# Altium project FLEXI_HAL_2000.PrjPCB (part 1 of 3)
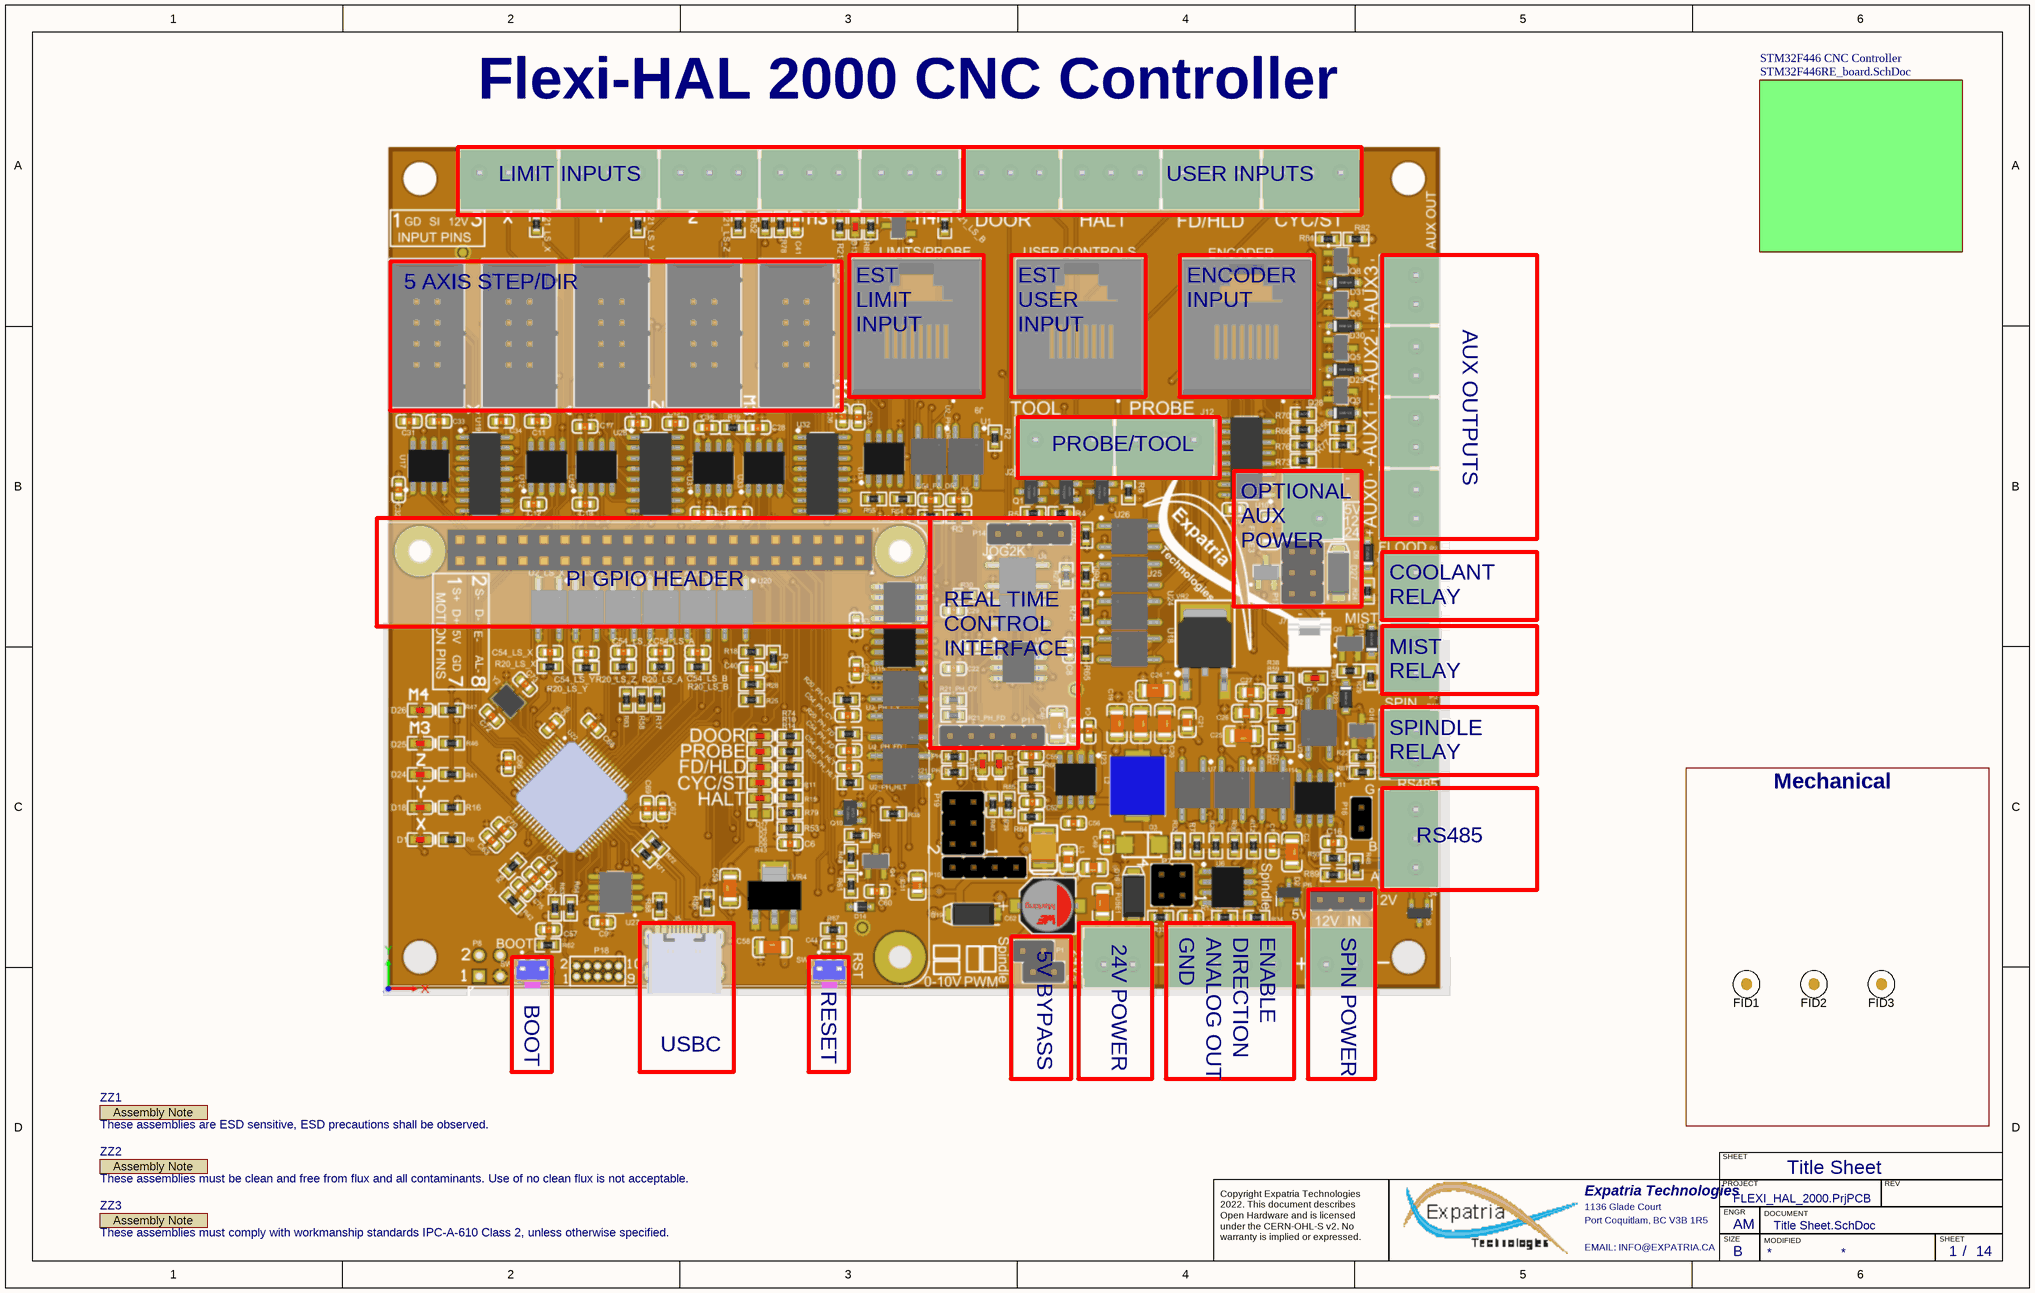
[diagram p0: Title Sheet.SchDoc]
PCBPARTNO: Flexi-HAL 2000; PCBREVNO: A7; Title: Flexi-HAL 2000; VarRevNo: A7
15 sheets, 343 parts. Net scope: hierarchical (ports join the sheet entries above them; power ports are global).
Board file: STMF446_CNC_board.pcbdoc
Sheets:
  Title Sheet.SchDoc
    STM32F446 CNC Controller = STM32F446RE_board.SchDoc
      LIM_SW = Limit_Switches.SchDoc
        LS_X = Photocoupler12Vinput.SchDoc
        LS_Y = Photocoupler12Vinput.SchDoc
        LS_Z = Photocoupler12Vinput.SchDoc
        LS_A = Photocoupler12Vinput.SchDoc
        LS_B = Photocoupler12Vinput.SchDoc
      USR_SW = Misc_switches.SchDoc
        PH_CY = Photocoupler12Vinput.SchDoc
        PH_FD = Photocoupler12Vinput.SchDoc
        PH_DR = Photocoupler12Vinput.SchDoc
        PH_PR = 2xparallelswitch.SchDoc
        PH_HLT = 2xparallelswitch_HALT.SchDoc
      ST = Stepper_driver_group.SchDoc
      SPINDLE = Spindle_Control.SchDoc
      EXT_KEYPAD = I2C_Keypad.SchDoc
      MODBUS = RS485.SchDoc
      Microcontroller = MCU_STM32F446RE.SchDoc
      Encoder Input = Spindle_Sync.SchDoc
      5V_Supply = 5V_Power_Supply.SchDoc
      AUX_OUTPUTS = Aux_Outputs.SchDoc

## Sheet Title Sheet.SchDoc: STM32F446 CNC
size B; Author: AM; CompanyName: Expatria Technologies; DrawnBy: A.Marles; Engineer: AM; Organization: Expatria Technolgoies; DocumentNumber: 1; Revision: A7; SheetNumber: 1; SheetTotal: 14

### Parts
FID1  Fiducial  [Fiducial10-20]  (value not drawn)  (no BOM)
FID2  Fiducial  [Fiducial10-20]  (value not drawn)  (no BOM)
FID3  Fiducial  [Fiducial10-20]  (value not drawn)  (no BOM)
ZZ1  These assemblies are ESD sensitive, ESD precautions shall be observed.  [AssemblyNote]  (graphical)
ZZ2  These assemblies must be clean and free from flux and all contaminants. Use of no clean flux is not acceptable.  [AssemblyNote]  (graphical)
ZZ3  These assemblies must comply with workmanship standards IPC-A-610 Class 2, unless otherwise specified.  [AssemblyNote]  (graphical)

### Blocks framed on the sheet
Mechanical: FID1-FID3

### Sub-sheets
STM32F446 CNC Controller = STM32F446RE_board.SchDoc: no entries

### Notes on the sheet
- Flexi-HAL 2000 CNC Controller
- LIMIT INPUTS
- USER INPUTS
- 5 AXIS STEP/DIR
- EST
  LIMIT
  INPUT
- EST
  USER
  INPUT
- ENCODER
  INPUT
- AUX OUTPUTS
- PROBE/TOOL
- OPTIONAL
  AUX
  POWER
- PI GPIO HEADER
- COOLANT
  RELAY
- MIST
  RELAY
- SPINDLE
  RELAY
- REAL TIME CONTROL INTERFACE
- RS485
- 5V BYPASS
- 24V POWER
- GND
- ANALOG OUT
- DIRECTION
- ENABLE
- SPIN POWER
- BOOT
- RESET
- USBC
- Title Sheet
- SHEET
- Expatria Technologies
- 1136 Glade Court
- Port Coquitlam, BC V3B 1R5
- PROJECT
- SIZE
- ENGR
- MODIFIED
- DOCUMENT
- REV
- Copyright Expatria Technologies 2022. This document describes Open Hardware and is licensed under the CERN-OHL-S v2. No warranty is implied or expressed.
- EMAIL: INFO@EXPATRIA.CA
- B
- /
- (in symbol AssemblyNote) Assembly Note

### Library data of the parts
FID1-FID3 = Fiducial: FIDUCIAL NO ASSEMBLY; Manufacturer 1: NONE; Manufacturer Part Number 1: NONE; Value: Fiducial
ZZ1-ZZ3 = AssemblyNote: SymbolCreator: codlsc; SymbolVersion: 2010-05-18; CompType: AssemblyNote; ClassName: AssemblyNote; Publisher: Texas Instruments; LatestRevisionDate: 2012-06-14; LatestRevisionNote: Initial Version; Alternate Manufacturer: -; Alternate PartNumber: -; Parameter 1: *

## Sheet STM32F446RE_board.SchDoc: RP2040 CNC
size C; Author: AM; CompanyName: Expatria Technologies; DrawnBy: A.Marles; Engineer: AM; Organization: Expatria Technolgoies; Address1: Schematic; DocumentNumber: 2; Revision: A7; SheetNumber: 2; SheetTotal: 14
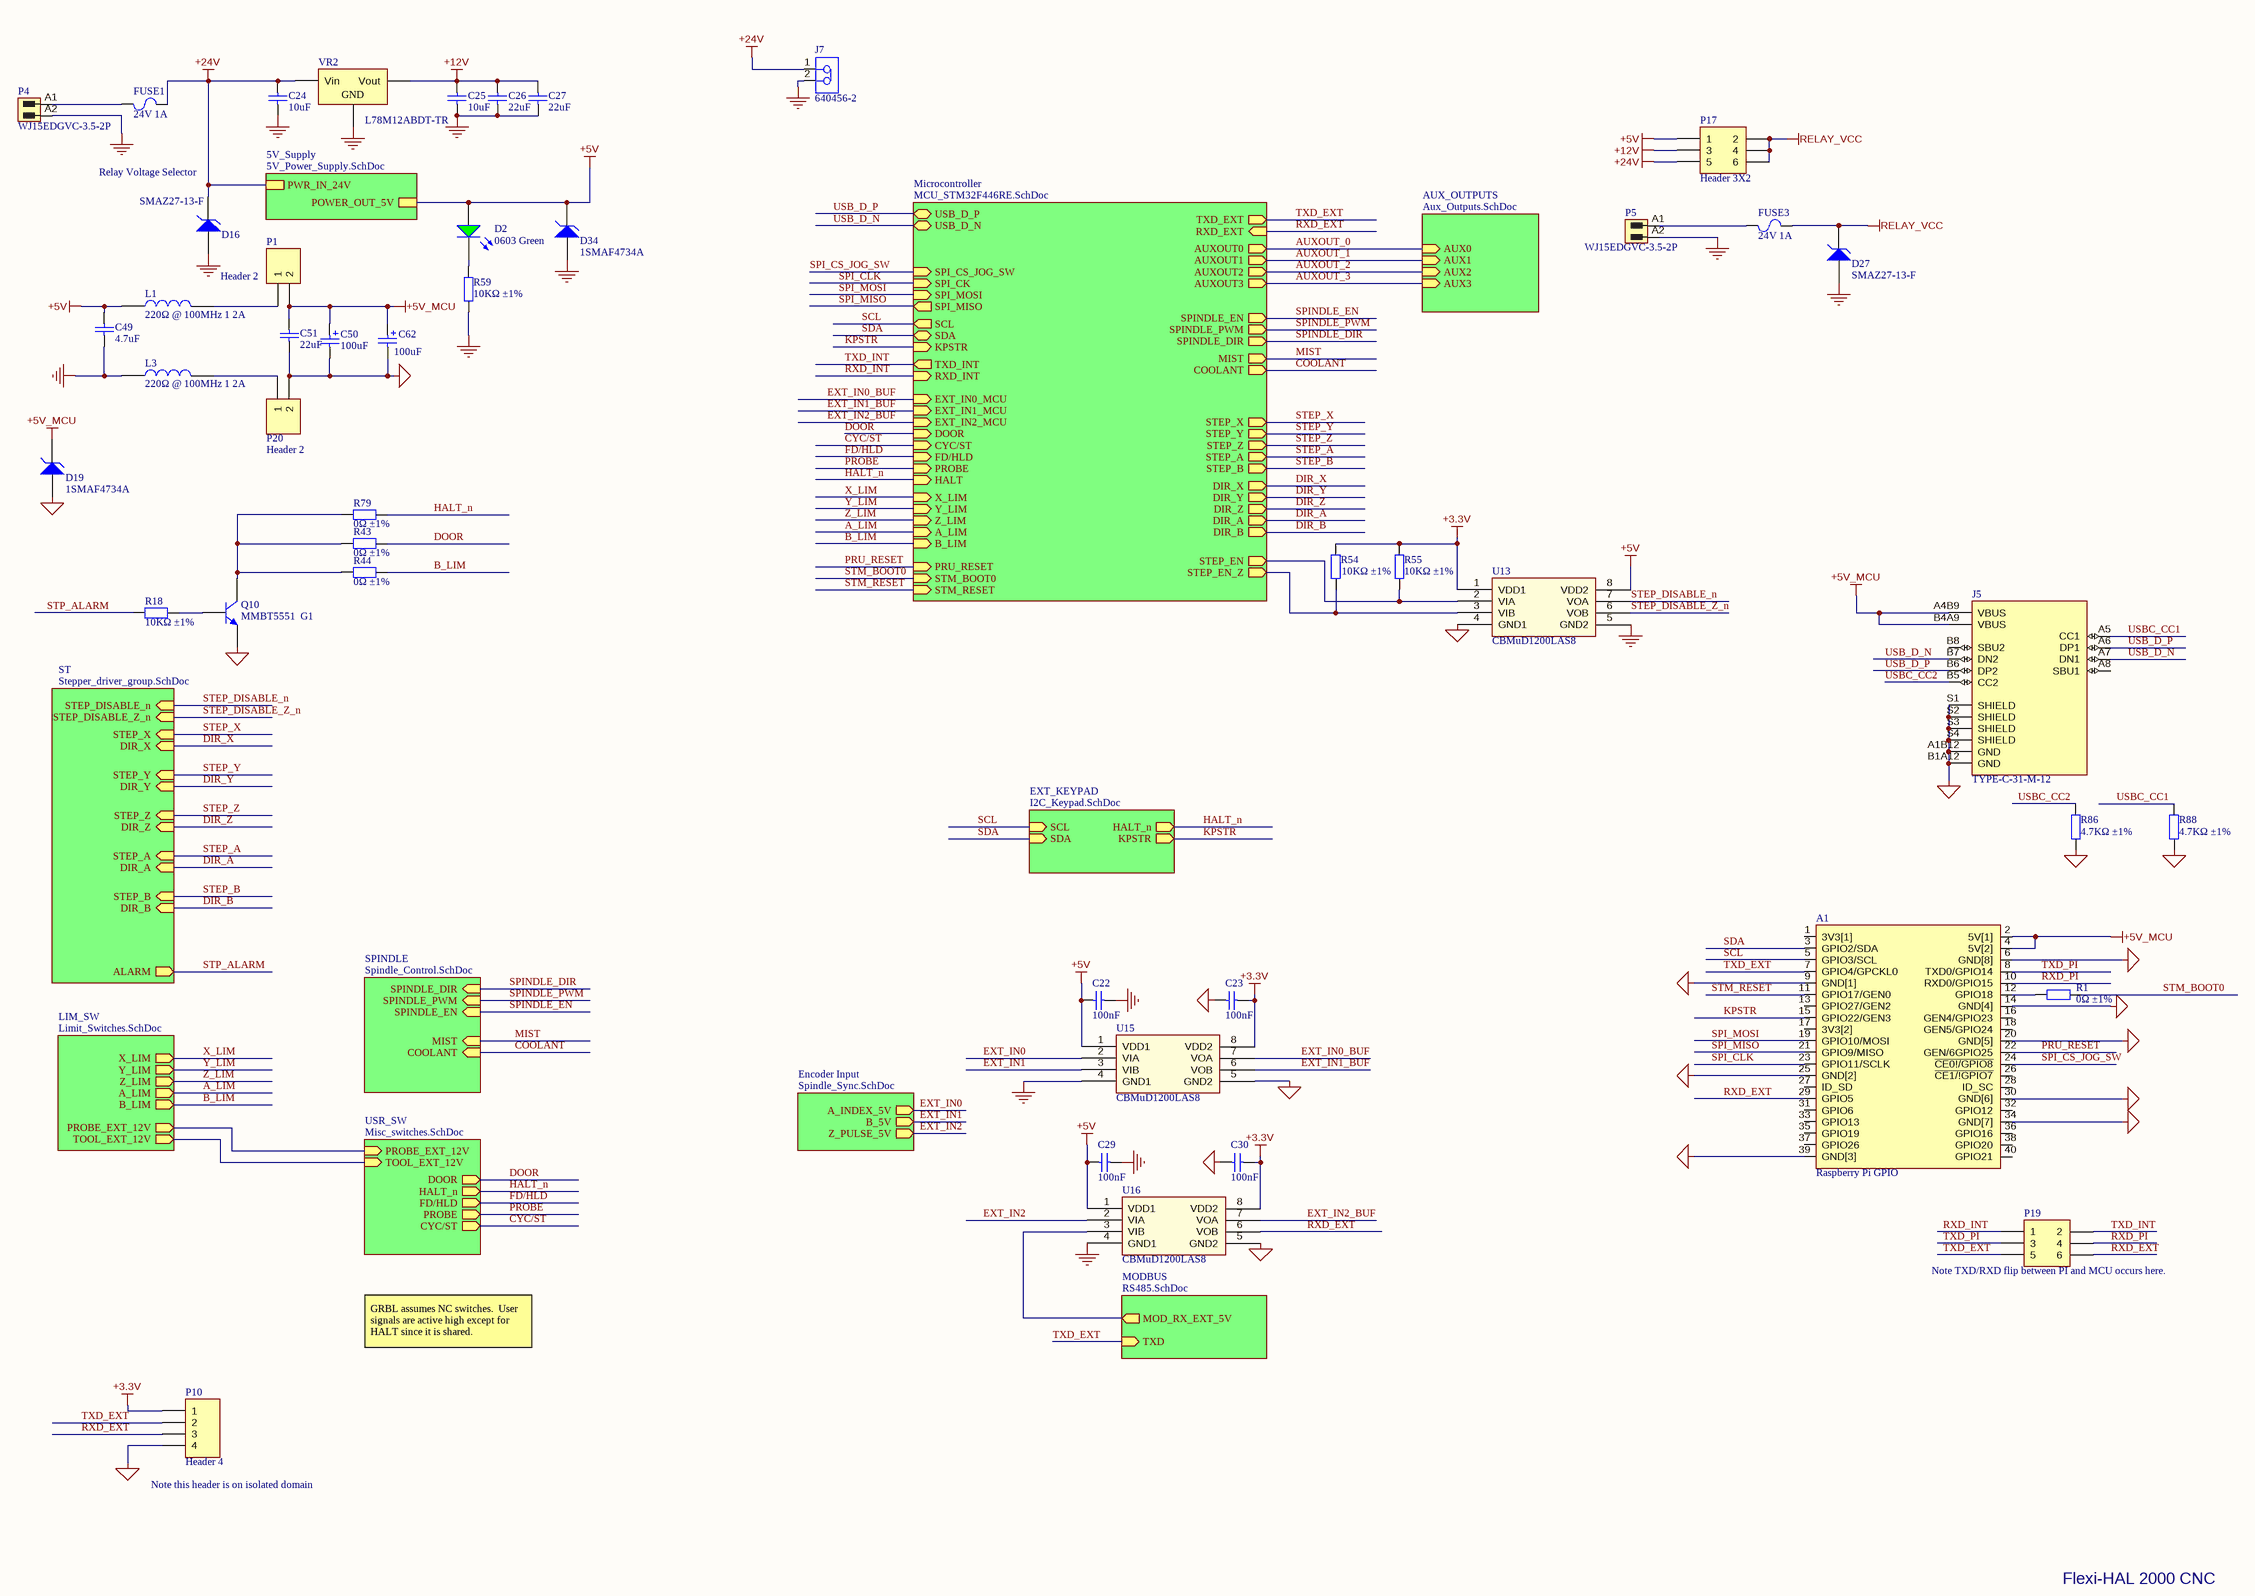
[diagram p1: STM32F446RE_board.SchDoc]

### Parts
A1  Raspberry Pi GPIO  [MODULE_RASPBERRY_PI_4_MODEL_B]
C22  100nF  [0603_C]
C23  100nF  [0603_C]
C24  10uF  [1206_C]
C25  10uF  [1206_C]
C26  22uF  [0805_C]
C27  22uF  [0805_C]
C29  100nF  [0603_C]
C30  100nF  [0603_C]
C49  4.7uF  [0603_C]
C50  100uF  [CASE-B_3528]
C51  22uF  [0805_C]
C62  100uF  [WCAP-ASLI_D6.3H7.7]
D2  0603 Green  [0603_LED_S1]
D16  SMAZ27-13-F  [DIOM5226X240N]
D19  1SMAF4734A  [DIOM5226X240N]
D27  SMAZ27-13-F  [DIOM5226X240N]
D34  1SMAF4734A  [DIOM5226X240N]
FUSE1  24V 1A  [1206_C]
FUSE3  24V 1A  [1206_C]
J5  TYPE-C-31-M-12  [HRO_TYPE-C-31-M-12]
J7  640456-2  [TECO-640456-2_V]
L1  220Ω @ 100MHz 1 2A  [0805_C]
L3  220Ω @ 100MHz 1 2A  [0805_C]
P1  Header 2  [HDR1X2]
P4  WJ15EDGVC-3.5-2P  [691321100002]
P5  WJ15EDGVC-3.5-2P  [691321100002]
P10  Header 4  [HDR1X4]
P17  Header 3X2  [HDR2X3]
P19  Header 3X2  [HDR2X3]  (value not drawn)
P20  Header 2  [HDR1X2]
Q10  MMBT5551  G1  [SOT-23(SOT-23-3)]
R1  0Ω ±1%  [0603_R]
R18  10KΩ ±1%  [0603_R]
R43  0Ω ±1%  [0603_R]
R44  0Ω ±1%  [0603_R]
R54  10KΩ ±1%  [0603_R]
R55  10KΩ ±1%  [0603_R]
R59  10KΩ ±1%  [0603_R]
R79  0Ω ±1%  [0603_R]
R86  4.7KΩ ±1%  [0603_R]
R88  4.7KΩ ±1%  [0603_R]
U13  CBMuD1200LAS8  [SOIC-8_150mil]
U15  CBMuD1200LAS8  [SOIC-8_150mil]
U16  CBMuD1200LAS8  [SOIC-8_150mil]
VR2  L78M12ABDT-TR  [TO-252-2-180]

### Sub-sheets
5V_Supply = 5V_Power_Supply.SchDoc: POWER_OUT_5V, PWR_IN_24V
AUX_OUTPUTS = Aux_Outputs.SchDoc: AUX3 (in), AUX0 (in), AUX1 (in), AUX2 (in)
Encoder Input = Spindle_Sync.SchDoc: A_INDEX_5V (out), Z_PULSE_5V (out), B_5V (out)
EXT_KEYPAD = I2C_Keypad.SchDoc: HALT_n (out), SCL (in), KPSTR (out), SDA (in)
LIM_SW = Limit_Switches.SchDoc: Y_LIM (out), Z_LIM (out), X_LIM (out), A_LIM (out), B_LIM (out), PROBE_EXT_12V (out), TOOL_EXT_12V (out)
Microcontroller = MCU_STM32F446RE.SchDoc: USB_D_P (bidir), EXT_IN2_MCU (in), DIR_B (out), EXT_IN1_MCU (in), RXD_INT (in), DIR_Y (out), EXT_IN0_MCU (in), USB_D_N (bidir), DIR_X (out), STEP_B (out), TXD_INT (out), STEP_A (out), SPI_CK (in), SPINDLE_PWM (out), STEP_Z (out), STEP_Y (out), SPI_MISO (out), SPI_MOSI (in), FD/HLD (in), STEP_X (out), CYC/ST (in), SPI_CS_JOG_SW (in), PROBE (in), AUXOUT3 (out), MIST (out), TXD_EXT (out), SDA (bidir), AUXOUT2 (out), AUXOUT0 (out), A_LIM (in), SCL (out), DIR_Z (out), KPSTR (in), RXD_EXT (in), COOLANT (out), SPINDLE_DIR (out), SPINDLE_EN (out), HALT (in), AUXOUT1 (out), DIR_A (out), PRU_RESET (in), X_LIM (in), Z_LIM (in), STM_BOOT0 (in), Y_LIM (in), STEP_EN (out), B_LIM (in), DOOR (in), STM_RESET (in), STEP_EN_Z (out)
MODBUS = RS485.SchDoc: TXD (in), MOD_RX_EXT_5V (out)
SPINDLE = Spindle_Control.SchDoc: SPINDLE_EN (in), SPINDLE_DIR (in), SPINDLE_PWM (in), COOLANT (in), MIST (in)
ST = Stepper_driver_group.SchDoc: STEP_Z (in), DIR_Z (in), STEP_X (in), STEP_B (in), DIR_X (in), DIR_A (in), DIR_Y (in), STEP_Y (in), DIR_B (in), STEP_A (in), ALARM (out), STEP_DISABLE_n (in), STEP_DISABLE_Z_n (in)
USR_SW = Misc_switches.SchDoc: FD/HLD (out), PROBE (out), CYC/ST (out), HALT_n (out), DOOR (out), PROBE_EXT_12V (in), TOOL_EXT_12V (in)

### Nets
+3.3V: C23.2 C30.2 P10.1 R54.1 R55.1 U13.1(VDD1) U15.8(VDD2) U16.8(VDD2)
+5V: C22.1 C29.1 C49.2 D2.A D34.2(K) L1.1 P17.1 U13.8(VDD2) U15.1(VDD1) U16.1(VDD1) ; sheet 5V_Supply/POWER_OUT_5V
+5V_MCU: A1.2(5V[1]) A1.4(5V[2]) C50.1 C51.2 C62.1(P) D19.2(K) J5.A4B9(VBUS) J5.B4A9(VBUS) P1.2
+12V: C25.2 C26.2 C27.2 P17.3 VR2.3(Vout)
+24V: C24.2 D16.2(K) FUSE1.2 J7.1 P17.5 VR2.1(Vin) ; sheet 5V_Supply/PWR_IN_24V
GND: C22.2 C24.1 C25.1 C26.1 C27.1 C29.2 C49.1 D16.1(A) D27.1(A) D34.1(A) J7.2 L3.1 P4.A2 P5.A2 R59.1 U13.5(GND2) U15.4(GND1) U16.4(GND1) VR2.2(GND)
MCU_GND: A1.6(GND[8]) A1.9(GND[1]) A1.14(GND[4]) A1.20(GND[5]) A1.25(GND[2]) A1.30(GND[6]) A1.34(GND[7]) A1.39(GND[3]) C23.1 C30.1 C50.2 C51.1 C62.2(N) D19.1(A) J5.A1B12(GND) J5.B1A12(GND) J5.S1(SHIELD) J5.S2(SHIELD) J5.S3(SHIELD) J5.S4(SHIELD) P10.4 P20.2 Q10.2(E) R86.2 R88.2 U13.4(GND1) U15.5(GND2) U16.5(GND2)
RELAY_VCC: D27.2(K) FUSE3.2 P17.2 P17.4 P17.6
A_LIM: sheet LIM_SW/A_LIM, sheet Microcontroller/A_LIM
AUXOUT_0: sheet Microcontroller/AUXOUT0, sheet AUX_OUTPUTS/AUX0
AUXOUT_1: sheet Microcontroller/AUXOUT1, sheet AUX_OUTPUTS/AUX1
AUXOUT_2: sheet Microcontroller/AUXOUT2, sheet AUX_OUTPUTS/AUX2
AUXOUT_3: sheet Microcontroller/AUXOUT3, sheet AUX_OUTPUTS/AUX3
B_LIM: R44.1 ; sheet LIM_SW/B_LIM, sheet Microcontroller/B_LIM
COOLANT: sheet SPINDLE/COOLANT, sheet Microcontroller/COOLANT
CYC/ST: sheet USR_SW/CYC/ST, sheet Microcontroller/CYC/ST
DIR_A: sheet ST/DIR_A, sheet Microcontroller/DIR_A
DIR_B: sheet ST/DIR_B, sheet Microcontroller/DIR_B
DIR_X: sheet ST/DIR_X, sheet Microcontroller/DIR_X
DIR_Y: sheet ST/DIR_Y, sheet Microcontroller/DIR_Y
DIR_Z: sheet ST/DIR_Z, sheet Microcontroller/DIR_Z
DOOR: R43.1 ; sheet USR_SW/DOOR, sheet Microcontroller/DOOR
EXT_IN0: U15.2(VIA) ; sheet Encoder Input/A_INDEX_5V
EXT_IN0_BUF: U15.7(VOA) ; sheet Microcontroller/EXT_IN0_MCU
EXT_IN1: U15.3(VIB) ; sheet Encoder Input/B_5V
EXT_IN1_BUF: U15.6(VOB) ; sheet Microcontroller/EXT_IN1_MCU
EXT_IN2: U16.2(VIA) ; sheet Encoder Input/Z_PULSE_5V
EXT_IN2_BUF: U16.7(VOA) ; sheet Microcontroller/EXT_IN2_MCU
FD/HLD: sheet USR_SW/FD/HLD, sheet Microcontroller/FD/HLD
HALT_n: R79.1 ; sheet USR_SW/HALT_n, sheet EXT_KEYPAD/HALT_n, sheet Microcontroller/HALT
KPSTR: A1.15(GPIO22/GEN3) ; sheet EXT_KEYPAD/KPSTR, sheet Microcontroller/KPSTR
MAXLIM: sheet LIM_SW/PROBE_EXT_12V, sheet USR_SW/PROBE_EXT_12V
MINLIM: sheet LIM_SW/TOOL_EXT_12V, sheet USR_SW/TOOL_EXT_12V
MIST: sheet SPINDLE/MIST, sheet Microcontroller/MIST
PROBE: sheet USR_SW/PROBE, sheet Microcontroller/PROBE
PRU_RESET: A1.22(GEN/6GPIO25) ; sheet Microcontroller/PRU_RESET
RXD_EXT: A1.29(GPIO5) P10.3 P19.6 U16.6(VOB) ; sheet Microcontroller/RXD_EXT
RXD_INT: P19.1 ; sheet Microcontroller/RXD_INT
RXD_OUT: U16.3(VIB) ; sheet MODBUS/MOD_RX_EXT_5V
RXD_PI: A1.10(RXD0/GPIO15) P19.4
SCL: A1.5(GPIO3/SCL) ; sheet EXT_KEYPAD/SCL, sheet Microcontroller/SCL
SDA: A1.3(GPIO2/SDA) ; sheet EXT_KEYPAD/SDA, sheet Microcontroller/SDA
SPI_CLK: A1.23(GPIO11/SCLK) ; sheet Microcontroller/SPI_CK
SPI_CS_JOG_SW: A1.24(~{CE0!/GPIO8}) ; sheet Microcontroller/SPI_CS_JOG_SW
SPI_MISO: A1.21(GPIO9/MISO) ; sheet Microcontroller/SPI_MISO
SPI_MOSI: A1.19(GPIO10/MOSI) ; sheet Microcontroller/SPI_MOSI
SPINDLE_DIR: sheet SPINDLE/SPINDLE_DIR, sheet Microcontroller/SPINDLE_DIR
SPINDLE_EN: sheet SPINDLE/SPINDLE_EN, sheet Microcontroller/SPINDLE_EN
SPINDLE_PWM: sheet SPINDLE/SPINDLE_PWM, sheet Microcontroller/SPINDLE_PWM
STEP_A: sheet ST/STEP_A, sheet Microcontroller/STEP_A
STEP_B: sheet ST/STEP_B, sheet Microcontroller/STEP_B
STEP_DISABLE_n: U13.7(VOA) ; sheet ST/STEP_DISABLE_n
STEP_DISABLE_Z_n: U13.6(VOB) ; sheet ST/STEP_DISABLE_Z_n
STEP_EN: R55.2 U13.2(VIA) ; sheet Microcontroller/STEP_EN
STEP_EN_Z: R54.2 U13.3(VIB) ; sheet Microcontroller/STEP_EN_Z
STEP_X: sheet ST/STEP_X, sheet Microcontroller/STEP_X
STEP_Y: sheet ST/STEP_Y, sheet Microcontroller/STEP_Y
STEP_Z: sheet ST/STEP_Z, sheet Microcontroller/STEP_Z
STM_BOOT0: R1.1 ; sheet Microcontroller/STM_BOOT0
STM_RESET: A1.11(GPIO17/GEN0) ; sheet Microcontroller/STM_RESET
STP_ALARM: R18.2 ; sheet ST/ALARM
TXD_EXT: A1.7(GPIO4/GPCKL0) P10.2 P19.5 ; sheet MODBUS/TXD, sheet Microcontroller/TXD_EXT
TXD_INT: P19.2 ; sheet Microcontroller/TXD_INT
TXD_PI: A1.8(TXD0/GPIO14) P19.3
USB_D_N: J5.A7(DN1) J5.B7(DN2) ; sheet Microcontroller/USB_D_N
USB_D_P: J5.A6(DP1) J5.B6(DP2) ; sheet Microcontroller/USB_D_P
USBC_CC1: J5.A5(CC1) R88.1
USBC_CC2: J5.B5(CC2) R86.1
X_LIM: sheet LIM_SW/X_LIM, sheet Microcontroller/X_LIM
Y_LIM: sheet LIM_SW/Y_LIM, sheet Microcontroller/Y_LIM
Z_LIM: sheet LIM_SW/Z_LIM, sheet Microcontroller/Z_LIM
NetA1_12: A1.12(GPIO18) R1.2
NetD2_K: D2.K R59.2
NetFUSE1_1: FUSE1.1 P4.A1
NetFUSE3_1: FUSE3.1 P5.A1
NetL1_2: L1.2 P1.1
NetL3_2: L3.2 P20.1
NetQ10_1: Q10.1(B) R18.1
NetQ10_3: Q10.3(C) R43.2 R44.2 R79.2

Not connected (* = marked no-connect by the designer): A1 1(3V3[1]) 13(GPIO27/GEN2) 16(GEN4/GPIO23) 17(3V3[2]) 18(GEN5/GPIO24) 26(~{CE1/!GPIO7}) 27(ID_SD) 28(ID_SC) 31(GPIO6) 32(GPIO12) 33(GPIO13) 35(GPIO19) 36(GPIO16) 37(GPIO26) 38(GPIO20) 40(GPIO21); J5 A8(SBU1) B8(SBU2)

### Notes on the sheet
- Relay Voltage Selector
- (near P19) Note TXD/RXD flip between PI and MCU occurs here.
- GRBL assumes NC switches.  User signals are active high except for HALT since it is shared.
- (near P10) Note this header is on isolated domain
- Flexi-HAL 2000 CNC
- Expatria Technologies
- SHEET
- PROJECT
- REV
- 1136 Glade Court
- Port Coquitlam, BC V3B 1R5
- EMAIL: INFO@EXPATRIA.CA
- SIZE
- ENGR
- C
- MODIFIED
- DOCUMENT
- /
- Copyright Expatria Technologies 2022. This document describes Open Hardware and is licensed under the CERN-OHL-S v2. No warranty is implied or expressed.

### Library data of the parts
A1 = ADA3708: Raspberry Pi Zero WH _Zero W with Headers_; MP: DS1023-2*20SF11; MF: CONNFLY Elec; Availability: Unavailable; Package: None; Value: *; Price: None; SuppliersPartNumber: C132132
C22 C23 C29 C30 = 0603 100nF (104) 10% 50V: Chip capacitors; Manufacturer: YAGEO; PartNumber: CC0603KRX7R9BB104; Tolerance: 10%; Voltage: 50V; ComponentLink1Description: Supplier link; ComponentLink1URL: http://www.szlcsc.com/product/details_15331.html; Package: 0603; Supplier: LC; SuppliersPartNumber: C14663; Capacitance: 100nF
C24 C25 = 1206 10uF (106) 10% 50V: Chip capacitors; Manufacturer: Samsung Electro-Mechanics; PartNumber: CL31A106KBHNNNE; Tolerance: 10%; Voltage: 50V; ComponentLink1Description: Supplier link; ComponentLink1URL: http://www.szlcsc.com/product/details_14236.html; Package: 1206; Supplier: LC; SuppliersPartNumber: C13585; Capacitance: 10uF
C26 C27 C51 = 0805 22uF (226) 20% 25V: Chip capacitors; Manufacturer: Samsung Electro-Mechanics; PartNumber: CL21A226MAQNNNE; Tolerance: 20%; Voltage: 25V; ComponentLink1Description: Supplier link; ComponentLink1URL: http://www.szlcsc.com/product/details_46786.html; Package: 0805; Supplier: LC; SuppliersPartNumber: C2922481; Capacitance: 22uF
C49 = 0603 4.7uF (475) 10% 16V: Chip capacitors; Manufacturer: Samsung Electro-Mechanics; PartNumber: CL10A475KO8NNNC; Tolerance: 10%; Voltage: 16V; ComponentLink1Description: Supplier link; ComponentLink1URL: http://www.szlcsc.com/product/details_20375.html; Package: 0603; Supplier: LC; SuppliersPartNumber: C19666; Capacitance: 4.7uF
C50 = 3528 100uF (107) 10% 6.3V: Tantalum capacitor; Manufacturer: AVX; PartNumber: TAJB107K006RNJ; Tolerance: 10%; Voltage: 6.3V; ComponentLink1Description: Supplier link; ComponentLink1URL: http://www.szlcsc.com/product/details_16815.html; Package: 3528; Supplier: LC; SuppliersPartNumber: C16133; Capacitance: 100uF
C62 = 865080445010: -45℃~+105℃ 2000hrs@105℃ 100uF 7.7mm 35V 6.3mm ±20% SMD,6.3x7.7mm Aluminum Electrolytic Capacitors - SMD ROHS; Manufacturer: Capxon International Elec; SuppliersPartNumber: C59934; Value: 100uF
D2 = 0603 LED Green: LED; ComponentLink1Description: 供应商链接; ComponentLink1URL: http://www.szlcsc.com/product/details_73152.html; Package: 0603; Supplier: LC; SuppliersPartNumber: C72043; Color: Green
D16 D19 D27 D34 = BZT52C27: 27V ±5% 1W 500nA @ 20.5V SMA(DO-214AC) Zener Diodes RoHS; ComponentLink1Description: 供应商链接; ComponentLink1URL: http://www.szlcsc.com/product/details_8541.html; Supplier: LC
  D16 D27: Package: SMA(DO-214AC); SuppliersPartNumber: C155318
  D19 D34: Package: SMAF; SuppliersPartNumber: C169539
FUSE1 FUSE3 = JK-nSMD050-24: 24V 1A 0.1s 1206 PTC Resettable Fuses RoHS; Manufacturer: Jinrui Electronic Materials Co.; Package: 1206; Supplier: LC; SuppliersPartNumber: C369160; PartNumber: JK-nSMD050-24
J5 = TYPE-C-31-M-12: USB Connectors 24 Receptacle 1 8.94*7.3mm RoHS; MF: HRO Electronics Co., Ltd.; Value: *; SnapEDA_Link: https://www.snapeda.com/parts/TYPE-C-31-M-12/HRO%20Electronics%20Co.,%20Ltd./view-part/3228496/?ref=snap; Package: Package; MP: TYPE-C-31-M-12; Price: None; Availability: Unavailable; SuppliersPartNumber: C2765186
J7 = CMP-2000-05417-1: Male Header, Pitch 2.54 mm, 1 x 2 Position, Height 10.49 mm, Tail Length 3.556 mm, -55 to 105 degC, RoHS, Bulk; Manufacturer: TE Connectivity; Standards: RoHSCompliant,ELVCompliant,UL94V-0; Material, Housing: Polyester; Agency Approvals: CSA,UL; Brand/Series: MTA-100Series; Contact Centerline Spacing: 0.100 / in.; Material, Contact: CopperAlloy; Current, Rating: 5 / A; Color, Housing: White; Contact Termination Area Plating: Tin; Special Features: Pinstrip; Number of Positions: 2; Pin Spacing: 0.1 / "; Temperature, Operating: -55to+105 / degC; Angle: Straight; Mount Angle: Vertical; Connector Type: MTA-100; Primary Type: InterconnectSystem; Voltage, Rating: 250 / V; Mounting Hole Size: 0.04 / "; Number of Rows: 1; Termination: Solder; Length, Terminal Post: 0.14 / in.; Manufacturer URL: http://www.te.com/; Color: White; Size, Post: 0.025 / in.; Contact Shape: Square; Mounting Type: PCMount; Datasheet URL: https://datasheet.ciiva.com/11746/0900766b80eb7fdd-11746365.pdf; Type: PCBPlug; Datasheet Version: Rev. W, 06/2004; Number of Contacts: 2; Flammability Rating: UL94V-0; Contact Plating: Tin; Length, Pin: 0.14 / "; Contact Mating Area Plating: Tin; Length, Overall: 0.2 / "; SuppliersPartNumber: C86502
L1 L3 = 0402 220R@100Mhz 0.1A: 220Ω @ 100MHz 1 2A 150mΩ 0805 Ferrite Beads ROHS; Notepad: *; Package: 0805; Supplier: LC; SuppliersPartNumber: C139188
P1 P20 = Header 2: Header, 2-Pin; Publisher: Altium Limited; LatestRevisionDate: 17-Jul-2002; LatestRevisionNote: Re-released for DXP Platform.; SuppliersPartNumber: C234182
P4 = 3.5mm Terminal Header 2p: Header,Male Pin,Covered(4 Sided) 2 1 0.138"（3.50mm） 2 P=3.5mm Pluggable System Terminal Block RoHS; UL_94_flammability_rating: V-0; Pitch_mm: 3.5 mm; ComponentLink1Description: Manufacturer URL; ComponentLink1URL: http://www.weidmueller.com/; Revision: V1; SuppliersPartNumber: C192777; Supplier: LCSC
P5 = 3.5mm Terminal Header 2p: Header,Male Pin,Covered(4 Sided) 2 1 0.138"（3.50mm） 2 P=3.5mm Pluggable System Terminal Block RoHS; Manufacturer: Weidmueller; Manufacturer 1: Weidmuller; Manufacturer Part Number 1: 1604470000; UL_94_flammability_rating: V-0; Pitch_mm: 3.5 mm; Side_termination_characteristic: closed side; Pitch_inch: 0.138 inch; Solder_pin_length_mm: 3.2 mm; Short_text_for_material: SL 3.50/02/180G 3.2SN OR BX; ComponentLink1Description: Manufacturer URL; ComponentLink1URL: http://www.weidmueller.com/; PartNumber: WJ15EDGVC-3.5-2P; Revision: V1; PackageReference: SL_3_50_180G_02; Packaging: Box; SuppliersPartNumber: C192777
P10 = Header 4: Header, 4-Pin; Supplier: LCSC; SuppliersPartNumber: C124378
P17 P19 = Header 3X2: Header, 3-Pin, Dual row; Publisher: Altium Limited; SuppliersPartNumber: C65114
Q10 = SOT-23 MMBT5551  G1: 三极管; ComponentLink1Description: 供应商链接; ComponentLink1URL: http://www.szlcsc.com/product/details_2502.html; Package: SOT-23; Supplier: LC; SuppliersPartNumber: C2145
R1 R43 R44 R79 = 0603 0R (0R0) 1%: Chip resistor; Manufacturer: Uniroyal Elec; PartNumber: 0603WAF0000T5E; Power: 1/10W; ComponentLink1Description: Supplier link; ComponentLink1URL: http://www.szlcsc.com/product/details_21903.html; Package: 0603; Supplier: LC; SuppliersPartNumber: C21189; Resistance: 0Ω; Tolerance: 1%
R18 R54 R55 R59 = 0603 10K (1002) 1%: Chip resistor; Manufacturer: Uniroyal Elec; PartNumber: 0603WAF1002T5E; Power: 1/10W; ComponentLink1Description: Supplier link; ComponentLink1URL: http://www.szlcsc.com/product/details_26547.html; Package: 0603; Supplier: LC; SuppliersPartNumber: C25804; Resistance: 10KΩ; Tolerance: 1%
R86 R88 = 0603 4.7K (4701) 1%: Chip resistor; Manufacturer: Uniroyal Elec; PartNumber: 0603WAF4701T5E; Power: 1/10W; ComponentLink1Description: Supplier link; ComponentLink1URL: http://www.szlcsc.com/product/details_23889.html; Package: 0603; Supplier: LC; SuppliersPartNumber: C23162; Resistance: 4.7KΩ; Tolerance: 1%
U13 U15 U16 = CBMuD1200LAS8: Dual Channel Isolator; Package: SOIC-8_150mil; Supplier: LC; SuppliersPartNumber: C476470; ComponentLink1Description: 供应商链接; ComponentLink1URL: http://www.szlcsc.com/product/details_10199.html
VR2 = TO-252-2 L78M05ABDT-TR: 500mA 55dB@(120Hz) Fixed 12V~12V Positive 1 35V TO-252-2(DPAK) Linear Voltage Regulators (LDO) ROHS; ComponentLink1Description: 供应商链接; ComponentLink1URL: http://www.szlcsc.com/product/details_59107.html; Package: TO-252-2; Supplier: digikey; SuppliersPartNumber: C16424

## Sheet Limit_Switches.SchDoc: RP2040 CNC
size B; Author: AM; CompanyName: Expatria Technologies; DrawnBy: A.Marles; Engineer: AM; Organization: Expatria Technolgoies; DocumentNumber: 7; Revision: A7; SheetNumber: 7; SheetTotal: 14
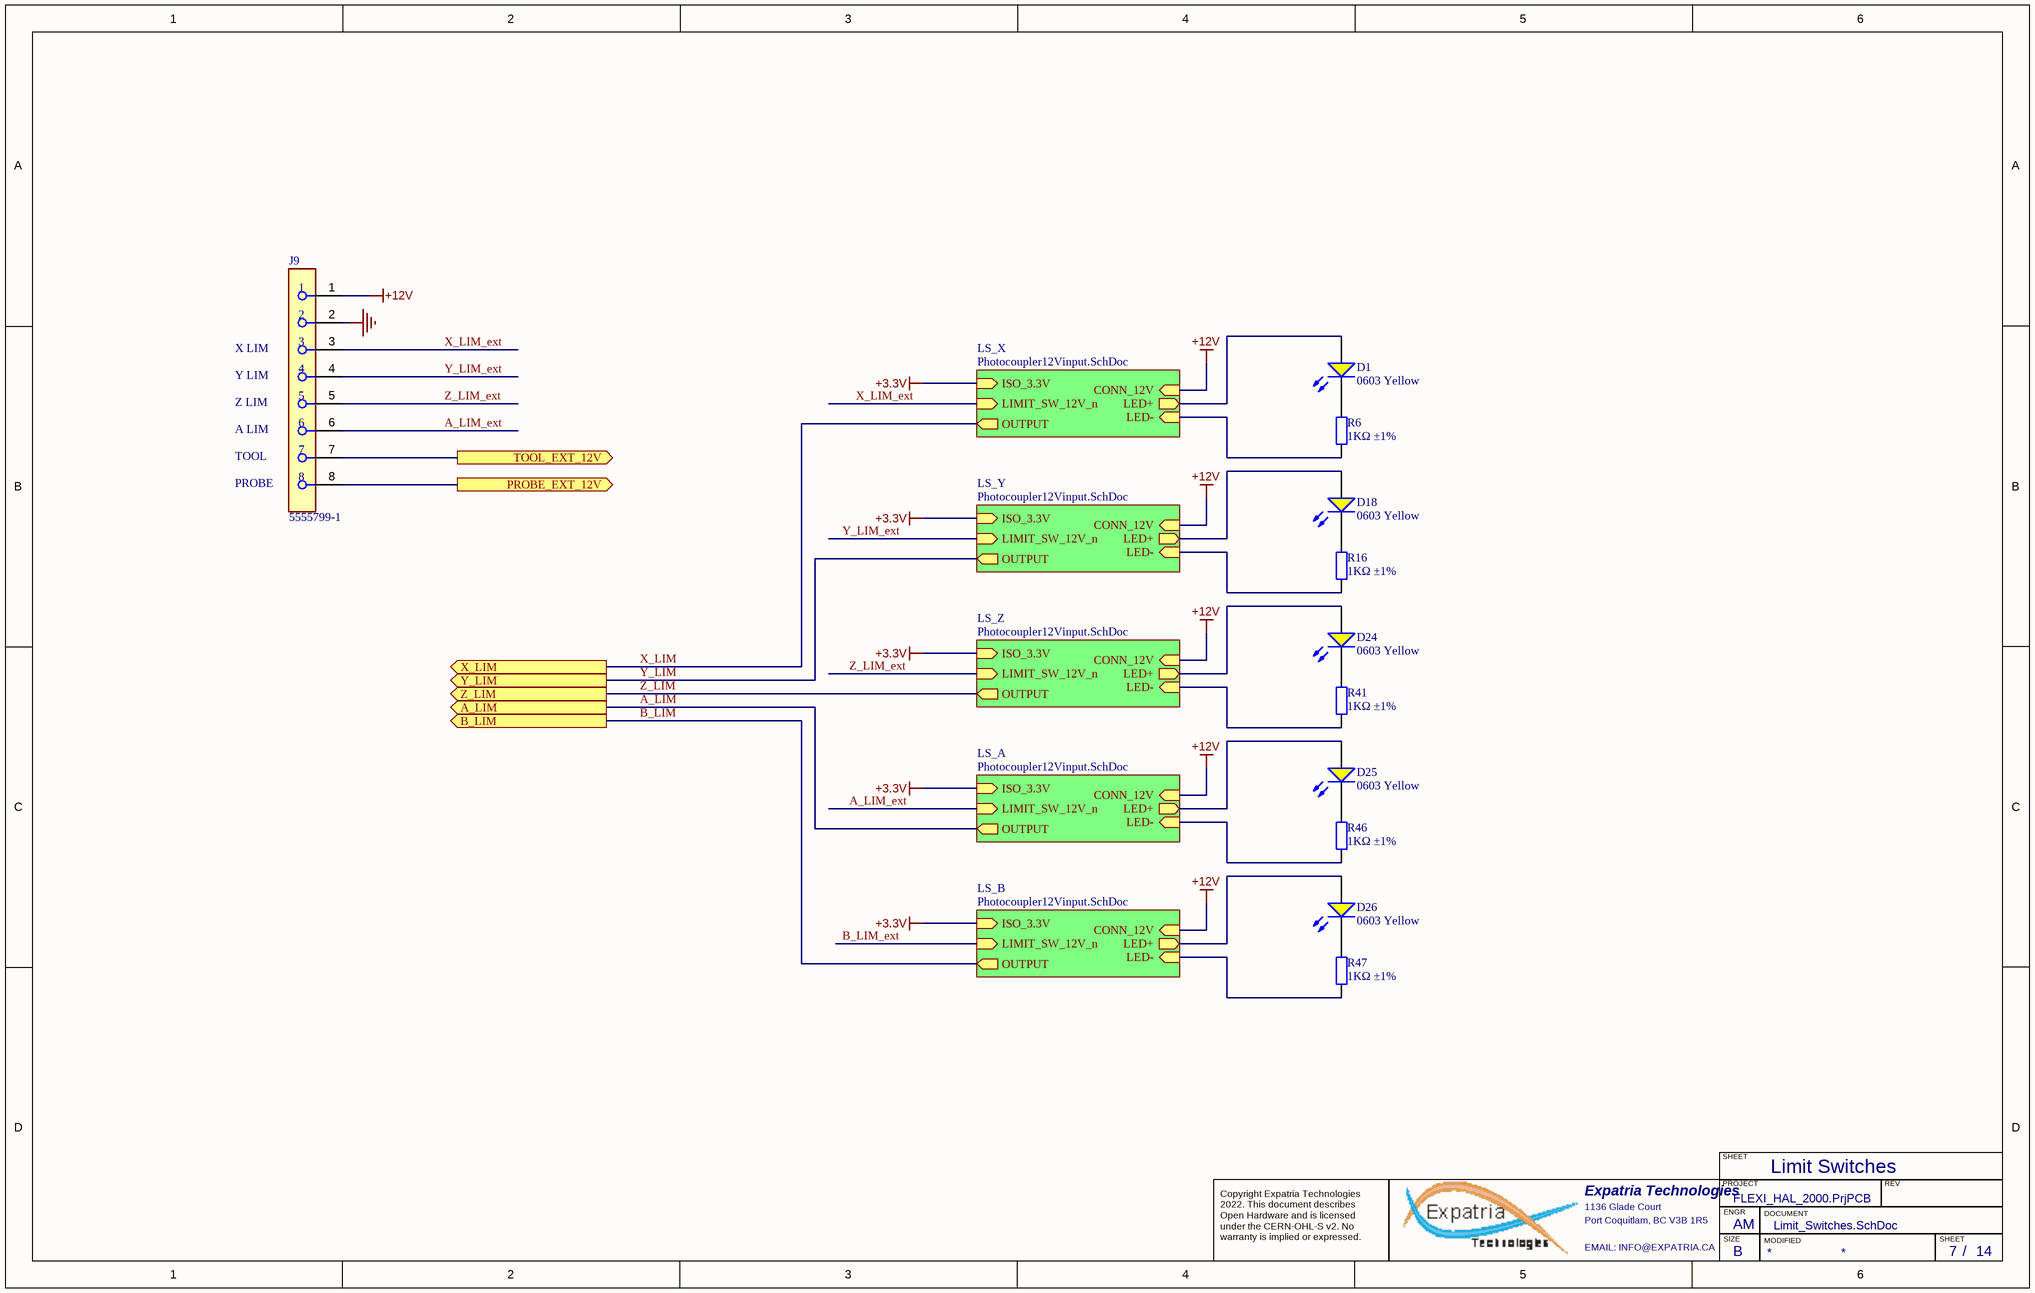
[diagram p2: Limit_Switches.SchDoc]

### Parts
D1  0603 Yellow  [0603_LED_S1]
D18  0603 Yellow  [0603_LED_S1]
D24  0603 Yellow  [0603_LED_S1]
D25  0603 Yellow  [0603_LED_S1]
D26  0603 Yellow  [0603_LED_S1]
J9  5555799-1  [FP-5555799-1-MFG]
R6  1KΩ ±1%  [0603_R]
R16  1KΩ ±1%  [0603_R]
R41  1KΩ ±1%  [0603_R]
R46  1KΩ ±1%  [0603_R]
R47  1KΩ ±1%  [0603_R]

### Sub-sheets
LS_A = Photocoupler12Vinput.SchDoc: OUTPUT (out), LED+ (out), LED- (in), CONN_12V (in), ISO_3.3V (in), LIMIT_SW_12V_n (in)
LS_B = Photocoupler12Vinput.SchDoc: OUTPUT (out), LED+ (out), LED- (in), CONN_12V (in), ISO_3.3V (in), LIMIT_SW_12V_n (in)
LS_X = Photocoupler12Vinput.SchDoc: OUTPUT (out), LED+ (out), LED- (in), CONN_12V (in), ISO_3.3V (in), LIMIT_SW_12V_n (in)
LS_Y = Photocoupler12Vinput.SchDoc: OUTPUT (out), LED+ (out), LED- (in), CONN_12V (in), ISO_3.3V (in), LIMIT_SW_12V_n (in)
LS_Z = Photocoupler12Vinput.SchDoc: OUTPUT (out), LED+ (out), LED- (in), CONN_12V (in), ISO_3.3V (in), LIMIT_SW_12V_n (in)

### Ports
A_LIM (out), B_LIM (out), PROBE_EXT_12V (out), TOOL_EXT_12V (out), X_LIM (out), Y_LIM (out), Z_LIM (out)

### Nets
+3.3V: D1.A D18.A D24.A D25.A D26.A ; sheet LS_X/LED+, sheet LS_X/ISO_3.3V, sheet LS_Y/LED+, sheet LS_Y/ISO_3.3V, sheet LS_Z/LED+, sheet LS_Z/ISO_3.3V, sheet LS_A/LED+, sheet LS_A/ISO_3.3V, sheet LS_B/LED+, sheet LS_B/ISO_3.3V
+12V: J9.1 ; sheet LS_X/CONN_12V, sheet LS_Y/CONN_12V, sheet LS_Z/CONN_12V, sheet LS_A/CONN_12V, sheet LS_B/CONN_12V
GND: J9.2
A_LIM: R46.2 ; port A_LIM, sheet LS_A/OUTPUT, sheet LS_A/LED-
A_LIM_ext: J9.6 ; sheet LS_A/LIMIT_SW_12V_n
B_LIM: R47.2 ; port B_LIM, sheet LS_B/OUTPUT, sheet LS_B/LED-
MAXLIM: J9.8 ; port PROBE_EXT_12V
MINLIM: J9.7 ; port TOOL_EXT_12V
X_LIM: R6.2 ; port X_LIM, sheet LS_X/OUTPUT, sheet LS_X/LED-
X_LIM_ext: J9.3 ; sheet LS_X/LIMIT_SW_12V_n
Y_LIM: R16.2 ; port Y_LIM, sheet LS_Y/OUTPUT, sheet LS_Y/LED-
Y_LIM_ext: J9.4 ; sheet LS_Y/LIMIT_SW_12V_n
Z_LIM: R41.2 ; port Z_LIM, sheet LS_Z/OUTPUT, sheet LS_Z/LED-
Z_LIM_ext: J9.5 ; sheet LS_Z/LIMIT_SW_12V_n
NetD1_K: D1.K R6.1
NetD18_K: D18.K R16.1
NetD24_K: D24.K R41.1
NetD25_K: D25.K R46.1
NetD26_K: D26.K R47.1

### Notes on the sheet
- (near J9) X LIM
- (near J9) Y LIM
- (near J9) Z LIM
- (near J9) A LIM
- TOOL
- (near J9) PROBE
- Limit Switches
- SHEET
- Expatria Technologies
- 1136 Glade Court
- Port Coquitlam, BC V3B 1R5
- PROJECT
- SIZE
- ENGR
- MODIFIED
- DOCUMENT
- REV
- Copyright Expatria Technologies 2022. This document describes Open Hardware and is licensed under the CERN-OHL-S v2. No warranty is implied or expressed.
- EMAIL: INFO@EXPATRIA.CA
- B
- /

### Library data of the parts
D1 D18 D24-D26 = 0603 LED Yellow: LED; ComponentLink1Description: 供应商链接; ComponentLink1URL: http://www.szlcsc.com/product/details_73147.html; Package: 0603; Supplier: LC; SuppliersPartNumber: C72038; Color: Yellow
J9 = CMP-03371-000003-1: CONN MOD JACK 8P8C VERT UNSHLD; Manufacturer: TE Connectivity; Pitch: 2.54mm; Number Of Contacts: 8; Is Female: yes; Device Class L3: unset; Manufacturer Part Number: 5555799-1; Temperature Range High: +85°C; Temperature Range Low: -40°C; Octopart: https://octopart.com/5555799-1-te+connectivity-39526335; Device Class L1: Connectors; Device Class L2: Modular / Ethernet Connectors; Mouser Description: Conn RJ-45 F 8 POS 2.54mm Solder ST Thru-Hole 8 Terminal 1 Port Cat 3 Box/Package/Tray; Digikey Description: CONN MOD JACK 8P8C VERT UNSHLD; Package: 5555799-1; Temperature: -40°C to +85°C; SuppliersPartNumber: C305983
R6 R16 R41 R46 R47 = 0603 1K (1001) 1%: Chip resistor; Manufacturer: Uniroyal Elec; PartNumber: 0603WAF1001T5E; Power: 1/10W; ComponentLink1Description: Supplier link; ComponentLink1URL: http://www.szlcsc.com/product/details_21904.html; Package: 0603; Supplier: LC; SuppliersPartNumber: C21190; Resistance: 1KΩ; Tolerance: 1%

## Sheet Photocoupler12Vinput.SchDoc: STM32F446 CNC
size B; Author: AM; CompanyName: Expatria Technologies; DrawnBy: A.Marles; Engineer: AM; Organization: Expatria Technolgoies; DocumentNumber: 14; Revision: A7; SheetNumber: 14; SheetTotal: 14
Used 8 times, as channels STM32F446 CNC Controller/LIM_SW/LS_X, STM32F446 CNC Controller/LIM_SW/LS_Y, STM32F446 CNC Controller/LIM_SW/LS_Z, STM32F446 CNC Controller/LIM_SW/LS_A, STM32F446 CNC Controller/LIM_SW/LS_B, STM32F446 CNC Controller/USR_SW/PH_CY, STM32F446 CNC Controller/USR_SW/PH_FD, STM32F446 CNC Controller/USR_SW/PH_DR. Parts and nets are listed once, with the designators drawn on the sheet.
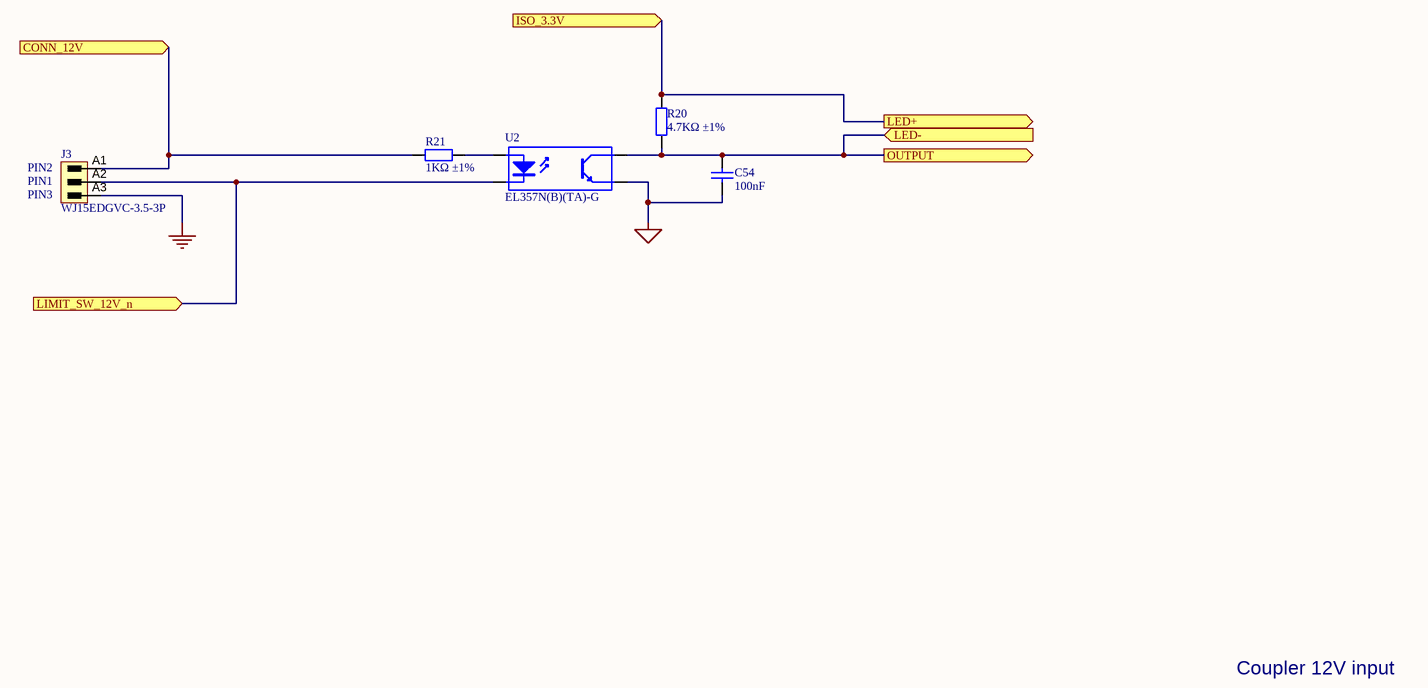
[diagram p3: Photocoupler12Vinput.SchDoc]

### Parts
C54  100nF  [0603_C]
J3  WJ15EDGVC-3.5-3P  [691321100003 - 3.5mm  3p]
R20  4.7KΩ ±1%  [0603_R]
R21  1KΩ ±1%  [0603_R]
U2  EL357N(B)(TA)-G  [SOP-4_P2.54]

### Ports
CONN_12V (in), ISO_3.3V (in), LED+ (out), LED- (in), LIMIT_SW_12V_n (in), OUTPUT (out)

### Nets
GND: J3.A3
MCU_GND: C54.1 U2.3(E)
CONN_12V: J3.A1 R21.1 ; port CONN_12V
ISO_3.3V: R20.2 ; port LED+, port ISO_3.3V
LED-: C54.2 R20.1 U2.4(C) ; port OUTPUT, port LED-
LIMIT_SW_12V_n: J3.A2 U2.2(K) ; port LIMIT_SW_12V_n
NetR21_2: R21.2 U2.1(A)

### Channels
STM32F446 CNC Controller/LIM_SW/LS_X: designators end in _LS_X; ports CONN_12V=+12V ISO_3.3V=+3.3V LED+=+3.3V LED-=X_LIM LIMIT_SW_12V_n=X_LIM_ext OUTPUT=X_LIM
STM32F446 CNC Controller/LIM_SW/LS_Y: designators end in _LS_Y; ports CONN_12V=+12V ISO_3.3V=+3.3V LED+=+3.3V LED-=Y_LIM LIMIT_SW_12V_n=Y_LIM_ext OUTPUT=Y_LIM
STM32F446 CNC Controller/LIM_SW/LS_Z: designators end in _LS_Z; ports CONN_12V=+12V ISO_3.3V=+3.3V LED+=+3.3V LED-=Z_LIM LIMIT_SW_12V_n=Z_LIM_ext OUTPUT=Z_LIM
STM32F446 CNC Controller/LIM_SW/LS_A: designators end in _LS_A; ports CONN_12V=+12V ISO_3.3V=+3.3V LED+=+3.3V LED-=A_LIM LIMIT_SW_12V_n=A_LIM_ext OUTPUT=A_LIM
STM32F446 CNC Controller/LIM_SW/LS_B: designators end in _LS_B; ports CONN_12V=+12V ISO_3.3V=+3.3V LED+=+3.3V LED-=B_LIM LIMIT_SW_12V_n=B_LIM_ext OUTPUT=B_LIM
STM32F446 CNC Controller/USR_SW/PH_CY: designators end in _PH_CY; ports CONN_12V=+12V ISO_3.3V=+3.3V LED+=+3.3V LED-=CYC/ST LIMIT_SW_12V_n=CYC/ST_out OUTPUT=CYC/ST
STM32F446 CNC Controller/USR_SW/PH_FD: designators end in _PH_FD; ports CONN_12V=+12V ISO_3.3V=+3.3V LED+=+3.3V LED-=FD/HLD LIMIT_SW_12V_n=HOLD_out OUTPUT=FD/HLD
STM32F446 CNC Controller/USR_SW/PH_DR: designators end in _PH_DR; ports CONN_12V=+12V ISO_3.3V=+3.3V LED+=+3.3V LED-=DOOR LIMIT_SW_12V_n=DOOR_out OUTPUT=DOOR

### Notes on the sheet
- (near J3) PIN2
- (near J3) PIN1
- (near J3) PIN3
- Coupler 12V input
- SHEET
- Expatria Technologies
- 1136 Glade Court
- Port Coquitlam, BC V3B 1R5
- PROJECT
- SIZE
- ENGR
- MODIFIED
- DOCUMENT
- REV
- Copyright Expatria Technologies 2022. This document describes Open Hardware and is licensed under the CERN-OHL-S v2. No warranty is implied or expressed.
- EMAIL: INFO@EXPATRIA.CA
- B
- /

### Library data of the parts
C54 = 0603 100nF (104) 10% 50V: as C22 on sheet STM32F446RE_board; ComponentLink1Description: Supplier link; ComponentLink1URL: http://www.szlcsc.com/product/details_15331.html; Package: 0603; Supplier: LC; SuppliersPartNumber: C14663; Capacitance: 100nF
J3 = 3.5mm Terminal Header 3p: Header,Male Pin,Covered(4 Sided) 3 1 0.138"（3.50mm） 3 P=3.5mm Pluggable System Terminal Block RoHS; Manufacturer: Ningbo Kangnex Elec; Pitch_mm: 3.5 mm; UL_94_flammability_rating: V-0; Side_termination_characteristic: closed side; Solder_pin_length_mm: 3.2 mm; Short_text_for_material: SL 3.50/03/180G 3.2SN OR BX; Pitch_inch: 0.138 inch; PartNumber: WJ15EDGVC-3.5-3P; PackageReference: SL_3_50_180G_03; ComponentLink1URL: http://www.weidmueller.com/; ComponentLink1Description: Manufacturer URL; Packaging: Box; Revision: V1; SuppliersPartNumber: C192778; Manufacturer 1: Ningbo Kangnex Elec; Manufacturer Part Number 1: WJ15EDGVC-3.5-3P; Package: P=3.5mm
R20 = 0603 4.7K (4701) 1%: as R86 on sheet STM32F446RE_board; ComponentLink1Description: Supplier link; ComponentLink1URL: http://www.szlcsc.com/product/details_23889.html; Package: 0603; Supplier: LC; SuppliersPartNumber: C23162; Resistance: 4.7KΩ; Tolerance: 1%
R21 = 0603 1K (1001) 1%: as R6 on sheet Limit_Switches; ComponentLink1Description: Supplier link; ComponentLink1URL: http://www.szlcsc.com/product/details_21904.html; Package: 0603; Supplier: LC; SuppliersPartNumber: C21190; Resistance: 1KΩ; Tolerance: 1%
U2 = EL357N(B)(TA)-G_[C6649]: OPTOISOLATOR 3.75KV TRANS 4-SOP; Manufacturer 1: Everlight Elec; ComponentLink1Description: 供应商链接; ComponentLink1URL: http://www.szlcsc.com/product/details_7114.html; Package: SOP-4_P2.54; Supplier: LC; SuppliersPartNumber: C6649; Manufacturer Part Number 1: EL357N(B)(TA)-G

## Sheet Misc_switches.SchDoc: RP2040 CNC
size B; Author: AM; CompanyName: Expatria Technologies; DrawnBy: A.Marles; Engineer: AM; Organization: Expatria Technolgoies; DocumentNumber: 8; Revision: A7; SheetNumber: 8; SheetTotal: 14
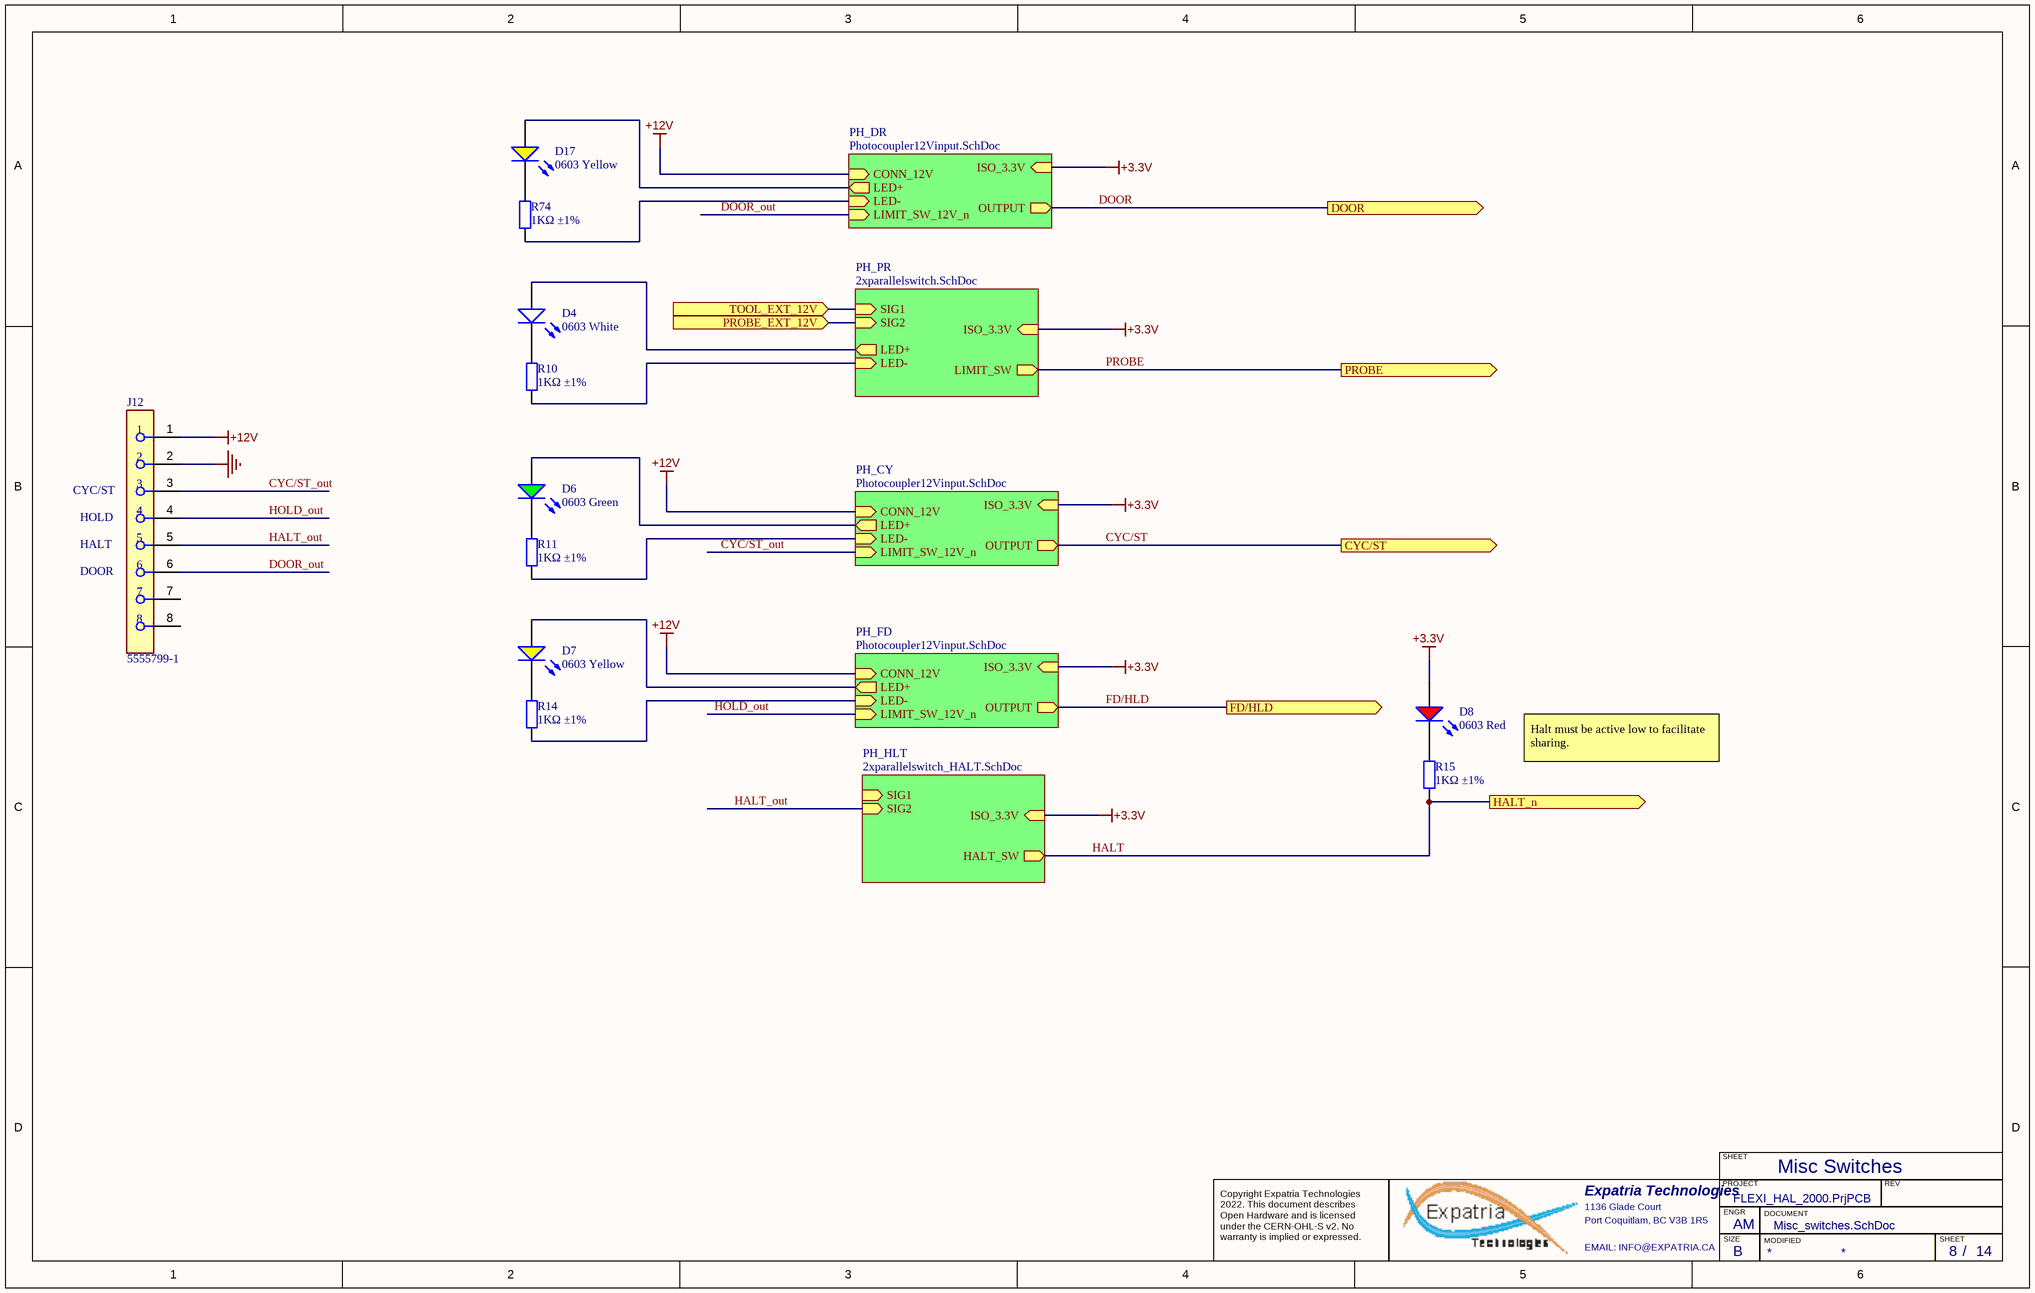
[diagram p4: Misc_switches.SchDoc]

### Parts
D4  0603 White  [0603_LED_S1]
D6  0603 Green  [0603_LED_S1]
D7  0603 Yellow  [0603_LED_S1]
D8  0603 Red  [0603_LED_S1]
D17  0603 Yellow  [0603_LED_S1]
J12  5555799-1  [FP-5555799-1-MFG]
R10  1KΩ ±1%  [0603_R]
R11  1KΩ ±1%  [0603_R]
R14  1KΩ ±1%  [0603_R]
R15  1KΩ ±1%  [0603_R]
R74  1KΩ ±1%  [0603_R]

### Sub-sheets
PH_CY = Photocoupler12Vinput.SchDoc: OUTPUT (out), LED- (in), LED+ (out), CONN_12V (in), ISO_3.3V (in), LIMIT_SW_12V_n (in)
PH_DR = Photocoupler12Vinput.SchDoc: OUTPUT (out), LED+ (out), LED- (in), CONN_12V (in), ISO_3.3V (in), LIMIT_SW_12V_n (in)
PH_FD = Photocoupler12Vinput.SchDoc: OUTPUT (out), LED+ (out), LED- (in), CONN_12V (in), ISO_3.3V (in), LIMIT_SW_12V_n (in)
PH_HLT = 2xparallelswitch_HALT.SchDoc: ISO_3.3V (in), SIG1 (in), SIG2 (in), HALT_SW (out)
PH_PR = 2xparallelswitch.SchDoc: LIMIT_SW (out), LED+ (out), ISO_3.3V (in), LED- (in), SIG1 (in), SIG2 (in)

### Ports
CYC/ST (out), DOOR (out), FD/HLD (out), HALT_n (out), PROBE (out), PROBE_EXT_12V (in), TOOL_EXT_12V (in)

### Nets
+3.3V: D4.A D6.A D7.A D8.A D17.A ; sheet PH_CY/LED+, sheet PH_CY/ISO_3.3V, sheet PH_FD/LED+, sheet PH_FD/ISO_3.3V, sheet PH_DR/LED+, sheet PH_DR/ISO_3.3V, sheet PH_PR/LED+, sheet PH_PR/ISO_3.3V, sheet PH_HLT/ISO_3.3V
+12V: J12.1 ; sheet PH_CY/CONN_12V, sheet PH_FD/CONN_12V, sheet PH_DR/CONN_12V
GND: J12.2
CYC/ST: R11.2 ; port CYC/ST, sheet PH_CY/OUTPUT, sheet PH_CY/LED-
CYC/ST_out: J12.3 ; sheet PH_CY/LIMIT_SW_12V_n
DOOR: R74.2 ; port DOOR, sheet PH_DR/OUTPUT, sheet PH_DR/LED-
DOOR_out: J12.6 ; sheet PH_DR/LIMIT_SW_12V_n
FD/HLD: R14.2 ; port FD/HLD, sheet PH_FD/OUTPUT, sheet PH_FD/LED-
HALT: R15.2 ; port HALT_n, sheet PH_HLT/HALT_SW  [project net HALT_n]
HALT_out: J12.5 ; sheet PH_HLT/SIG2
HOLD_out: J12.4 ; sheet PH_FD/LIMIT_SW_12V_n
MAXLIM: port PROBE_EXT_12V, sheet PH_PR/SIG2
MINLIM: port TOOL_EXT_12V, sheet PH_PR/SIG1
PROBE: R10.2 ; port PROBE, sheet PH_PR/LIMIT_SW, sheet PH_PR/LED-
NetD4_K: D4.K R10.1
NetD6_K: D6.K R11.1
NetD7_K: D7.K R14.1
NetD8_K: D8.K R15.1
NetD17_K: D17.K R74.1

Not connected (* = marked no-connect by the designer): J12 7 8

### Notes on the sheet
- (near J12) CYC/ST
- (near J12) HOLD
- (near J12) HALT
- (near J12) DOOR
- Halt must be active low to facilitate sharing.
- Misc Switches
- SHEET
- Expatria Technologies
- 1136 Glade Court
- Port Coquitlam, BC V3B 1R5
- PROJECT
- SIZE
- ENGR
- MODIFIED
- DOCUMENT
- REV
- Copyright Expatria Technologies 2022. This document describes Open Hardware and is licensed under the CERN-OHL-S v2. No warranty is implied or expressed.
- EMAIL: INFO@EXPATRIA.CA
- B
- /

### Library data of the parts
D4 = 0603 LED White: LED; ComponentLink1Description: 供应商链接; ComponentLink1URL: http://www.szlcsc.com/product/details_2663.html; Package: 0603; Supplier: LC; SuppliersPartNumber: C2290; Color: White
D6 = 0603 LED Green: LED; ComponentLink1Description: 供应商链接; ComponentLink1URL: http://www.szlcsc.com/product/details_73152.html; Package: 0603; Supplier: LC; SuppliersPartNumber: C72043; Color: Green
D7 D17 = 0603 LED Yellow: LED; ComponentLink1Description: 供应商链接; ComponentLink1URL: http://www.szlcsc.com/product/details_73147.html; Package: 0603; Supplier: LC; SuppliersPartNumber: C72038; Color: Yellow
D8 = 0603 LED Red: LED; ComponentLink1Description: 供应商链接; ComponentLink1URL: http://www.szlcsc.com/product/details_2659.html; Package: 0603; Supplier: LC; SuppliersPartNumber: C2286; Color: Red
J12 = CMP-03371-000003-1: as J9 on sheet Limit_Switches; Device Class L3: unset; Manufacturer Part Number: 5555799-1; Temperature Range High: +85°C; Temperature Range Low: -40°C; Octopart: https://octopart.com/5555799-1-te+connectivity-39526335; Device Class L1: Connectors; Device Class L2: Modular / Ethernet Connectors; Mouser Description: Conn RJ-45 F 8 POS 2.54mm Solder ST Thru-Hole 8 Terminal 1 Port Cat 3 Box/Package/Tray; Digikey Description: CONN MOD JACK 8P8C VERT UNSHLD; Package: 5555799-1; Temperature: -40°C to +85°C; SuppliersPartNumber: C305983
R10 R11 R14 R15 R74 = 0603 1K (1001) 1%: as R6 on sheet Limit_Switches; ComponentLink1Description: Supplier link; ComponentLink1URL: http://www.szlcsc.com/product/details_21904.html; Package: 0603; Supplier: LC; SuppliersPartNumber: C21190; Resistance: 1KΩ; Tolerance: 1%

## Sheet 2xparallelswitch.SchDoc: RP2040 CNC
size B; Author: AM; CompanyName: Expatria Technologies; DrawnBy: A.Marles; Engineer: AM; Organization: Expatria Technolgoies; DocumentNumber: 13; Revision: A7; SheetNumber: 13; SheetTotal: 14
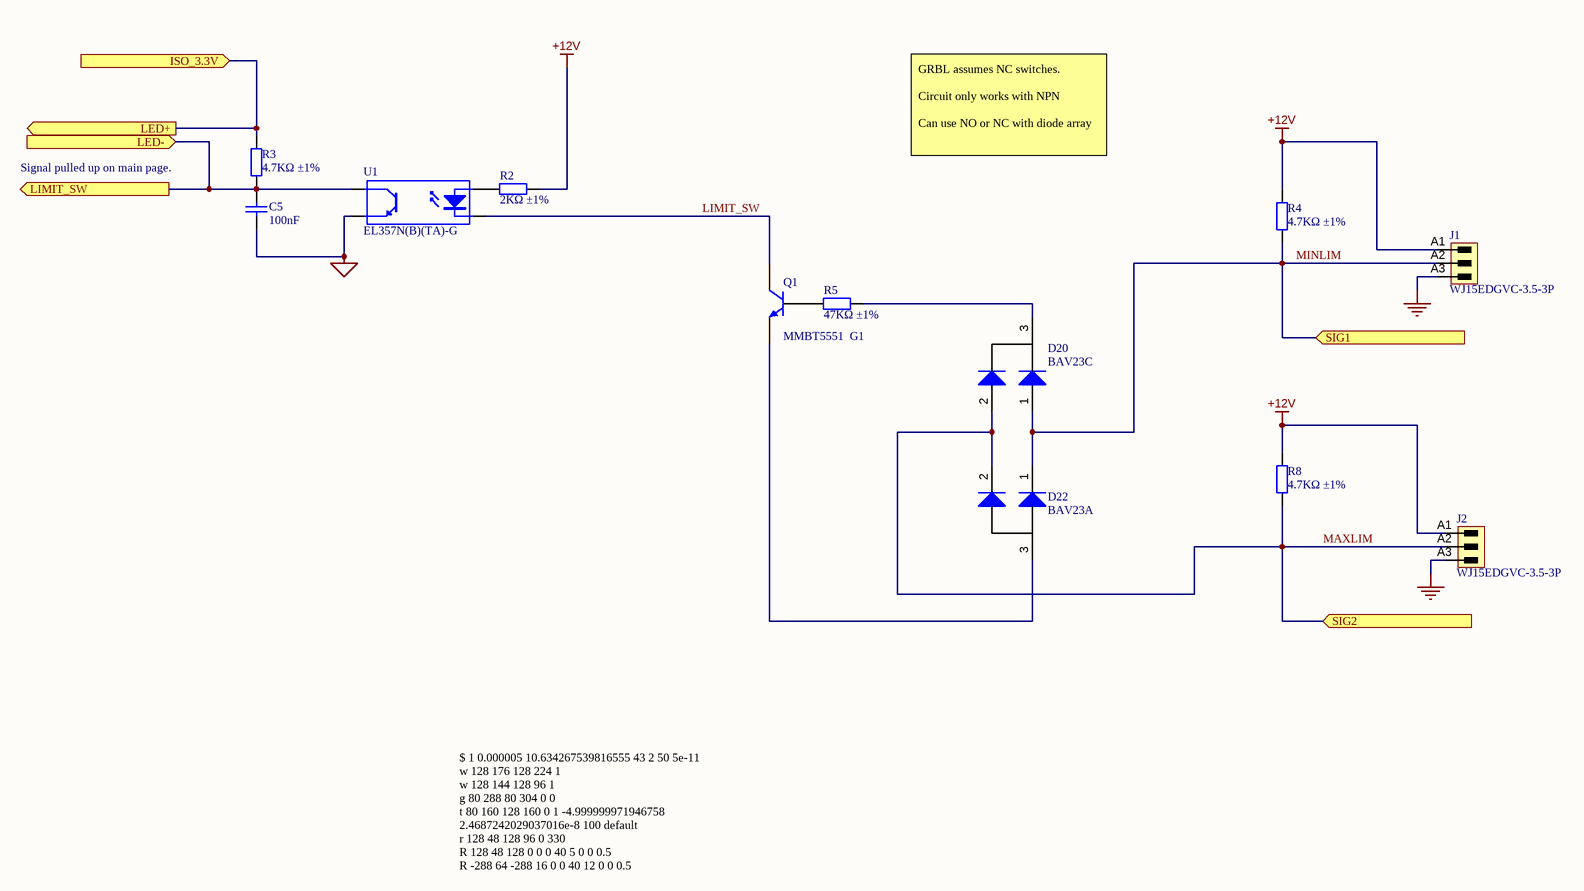
[diagram p5: 2xparallelswitch.SchDoc]

### Parts
C5  100nF  [0603_C]
D20  BAV23C  [SOT-23(SOT-23-3)]
D22  BAV23A  [SOT-23(SOT-23-3)]
J1  WJ15EDGVC-3.5-3P  [691321100003 - 3.5mm  3p]
J2  WJ15EDGVC-3.5-3P  [691321100003 - 3.5mm  3p]
Q1  MMBT5551  G1  [SOT-23(SOT-23-3)]
R2  2KΩ ±1%  [0603_R]
R3  4.7KΩ ±1%  [0603_R]
R4  4.7KΩ ±1%  [0603_R]
R5  47KΩ ±1%  [0603_R]
R8  4.7KΩ ±1%  [0603_R]
U1  EL357N(B)(TA)-G  [SOP-4_P2.54]

### Ports
ISO_3.3V (in), LED+ (out), LED- (in), LIMIT_SW (out), SIG1 (in), SIG2 (in)

### Nets
+3.3V: R3.2 ; port LED+, port ISO_3.3V
+12V: J1.A1 J2.A1 R2.2 R4.2 R8.2
GND: J1.A3 J2.A3
MCU_GND: C5.1 U1.3(E)
LIMIT_SW: Q1.3(C) U1.2(K)
MAXLIM: D20.2(A) D22.2(K) J2.A2 R8.1 ; port SIG2
MINLIM: D20.1(A) D22.1(K) J1.A2 R4.1 ; port SIG1
PROBE: C5.2 R3.1 U1.4(C) ; port LIMIT_SW, port LED-
NetD20_3: D20.3(K) R5.1
NetD22_3: D22.3(A) Q1.2(E)
NetQ1_1: Q1.1(B) R5.2
NetR2_1: R2.1 U1.1(A)

### Notes on the sheet
- Signal pulled up on main page.
- GRBL assumes NC switches.
  Circuit only works with NPN
  Can use NO or NC with diode array
- $ 1 0.000005 10.634267539816555 43 2 50 5e-11
  w 128 176 128 224 1
  w 128 144 128 96 1
  g 80 288 80 304 0 0
  t 80 160 128 160 0 1 -4.999999971946758 2.4687242029037016e-8 100 default
  r 128 48 128 96 0 330
  R 128 48 128 0 0 0 40 5 0 0 0.5
  R -288 64 -288 16 0 0 40 12 0 0 0.5
  368 128 144 288 144 0 0
  r -288 64 -288 144 0 1000
  r 80 208 80 288 0 5000
  w 128 224 128 240 0
  r 80 160 -16 160 0 1000
  g 128 240 128 256 0 0
  s -288 160 -432 160 0 0 false
  g -432 160 -432 208 0 0
  w -288 144 -288 160 0
  w -288 160 -224 160 0
  368 -432 160 -432 96 0 0
  368 -16 160 -16 96 0 0
  368 80 160 80 96 0 0
  368 128 224 256 224 0 0
  w 80 160 80 208 0
  368 -432 416 -432 352 0 0
  w -288 416 -224 416 0
  w -288 400 -288 416 0
  g -432 416 -432 464 0 0
  s -288 416 -432 416 0 0 false
  r -288 320 -288 400 0 1000
  R -288 320 -288 272 0 0 40 12 0 0 0.5
  d -224 160 -112 160 2 default
  d -224 416 -112 416 2 default
  w -112 416 -112 160 0
  w -112 160 -16 160 0
- SHEET
- Expatria Technologies
- 1136 Glade Court
- Port Coquitlam, BC V3B 1R5
- PROJECT
- SIZE
- ENGR
- MODIFIED
- DOCUMENT
- REV
- Copyright Expatria Technologies 2022. This document describes Open Hardware and is licensed under the CERN-OHL-S v2. No warranty is implied or expressed.
- EMAIL: INFO@EXPATRIA.CA
- B
- /

### Library data of the parts
C5 = 0603 100nF (104) 10% 50V: as C22 on sheet STM32F446RE_board; ComponentLink1Description: Supplier link; ComponentLink1URL: http://www.szlcsc.com/product/details_15331.html; Package: 0603; Supplier: LC; SuppliersPartNumber: C14663; Capacitance: 100nF
D20 = SOT-23 BAV23C: 250V +150℃@(Tj) 350mW Dual Common Cathode 1.25V@200mA 50ns 100nA@250V 225mA SOT-23 Switching Diode ROHS; ComponentLink1Description: 供应商链接; ComponentLink1URL: http://www.szlcsc.com/product/details_70091.html; Package: SOT-23; Supplier: LC; SuppliersPartNumber: C545540
D22 = SOT-23 BAV23A: 200V -65℃~+150℃@(Tj) 350mW 1 Pair Common Anode 1.25V@200mA 50ns 100nA@200V 400mA SOT-23 Switching Diode ROHS; ComponentLink1Description: 供应商链接; ComponentLink1URL: http://www.szlcsc.com/product/details_70091.html; Package: SOT-23; Supplier: LC; SuppliersPartNumber: C328584
J1 J2 = 3.5mm Terminal Header 3p: Header,Male Pin,Covered(4 Sided) 3 1 0.138"（3.50mm） 3 P=3.5mm Pluggable System Terminal Block RoHS; Manufacturer: Weidmueller; Manufacturer 1: Weidmuller; Manufacturer Part Number 1: 1604480000; Pitch_mm: 3.5 mm; UL_94_flammability_rating: V-0; Side_termination_characteristic: closed side; Solder_pin_length_mm: 3.2 mm; Short_text_for_material: SL 3.50/03/180G 3.2SN OR BX; Pitch_inch: 0.138 inch; PartNumber: WJ15EDGVC-3.5-3P; PackageReference: SL_3_50_180G_03; ComponentLink1URL: http://www.weidmueller.com/; ComponentLink1Description: Manufacturer URL; Packaging: Box; Revision: V1; SuppliersPartNumber: C192778
Q1 = SOT-23 MMBT5551  G1: 三极管; ComponentLink1Description: 供应商链接; ComponentLink1URL: http://www.szlcsc.com/product/details_2502.html; Package: SOT-23; Supplier: LC; SuppliersPartNumber: C2145
R2 = 0603 2K (2001) 1%: Chip resistor; Manufacturer: Uniroyal Elec; PartNumber: 0603WAF2001T5E; Power: 1/10W; ComponentLink1Description: Supplier link; ComponentLink1URL: http://www.szlcsc.com/product/details_23702.html; Package: 0603; Supplier: LC; SuppliersPartNumber: C22975; Resistance: 2KΩ; Tolerance: 1%
R3 R4 R8 = 0603 4.7K (4701) 1%: as R86 on sheet STM32F446RE_board; ComponentLink1Description: Supplier link; ComponentLink1URL: http://www.szlcsc.com/product/details_23889.html; Package: 0603; Supplier: LC; SuppliersPartNumber: C23162; Resistance: 4.7KΩ; Tolerance: 1%
R5 = 0603 47K (4702) 1%: Chip resistor; Manufacturer: Uniroyal Elec; PartNumber: 0603WAF4702T5E; Power: 1/10W; ComponentLink1Description: Supplier link; ComponentLink1URL: http://www.szlcsc.com/product/details_26562.html; Package: 0603; Supplier: LC; SuppliersPartNumber: C25819; Resistance: 47KΩ; Tolerance: 1%
U1 = EL357N(B)(TA)-G_[C6649]: 贴片光耦; ComponentLink1Description: 供应商链接; ComponentLink1URL: http://www.szlcsc.com/product/details_7114.html; Package: SOP-4_P2.54; Supplier: LC; SuppliersPartNumber: C6649

## Sheet 2xparallelswitch_HALT.SchDoc: RP2040 CNC
size B; Author: AM; CompanyName: Expatria Technologies; DrawnBy: A.Marles; Engineer: AM; Organization: Expatria Technolgoies; DocumentNumber: 13; Revision: A7; SheetNumber: 13; SheetTotal: 14
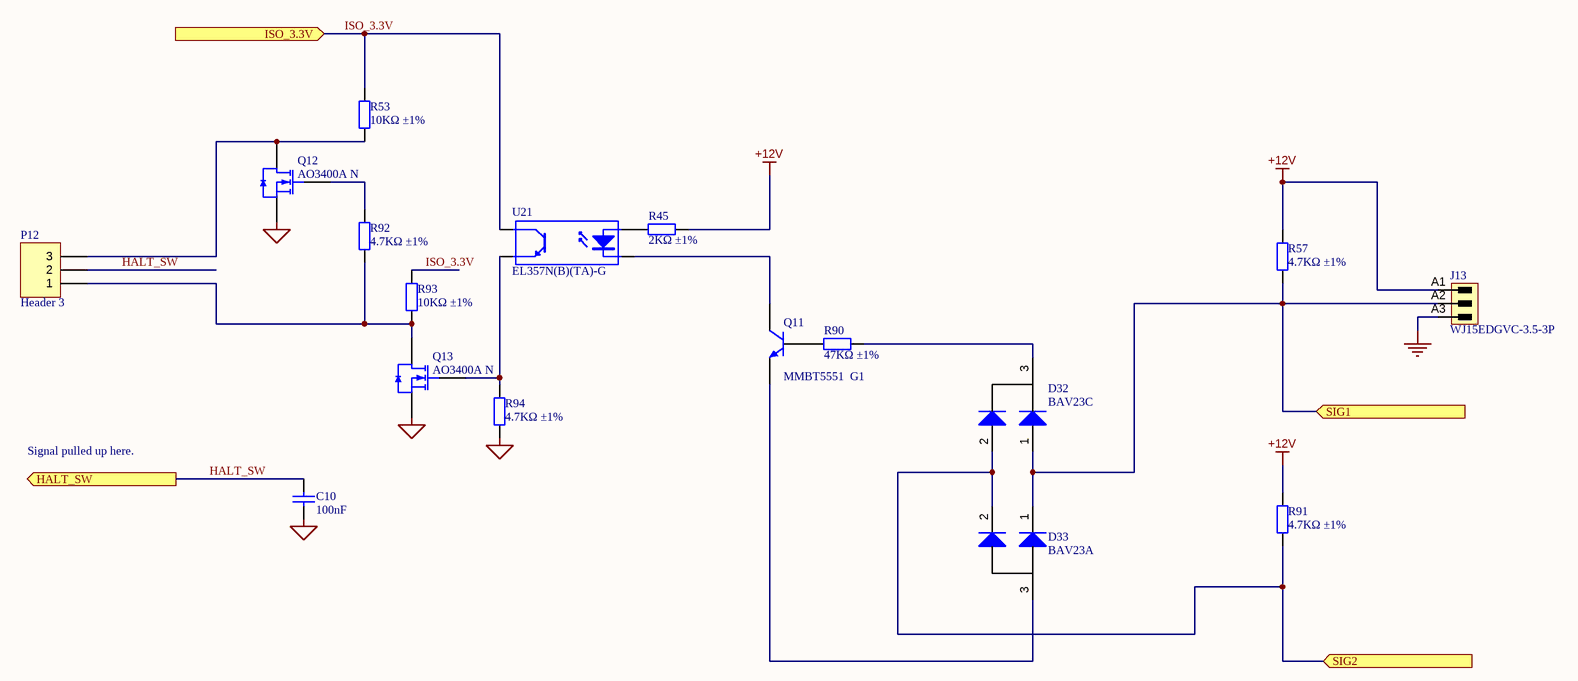
[diagram p6: 2xparallelswitch_HALT.SchDoc]

### Parts
C10  100nF  [0603_C]
D32  BAV23C  [SOT-23(SOT-23-3)]
D33  BAV23A  [SOT-23(SOT-23-3)]
J13  WJ15EDGVC-3.5-3P  [691321100003 - 3.5mm  3p]
P12  Header 3  [HDR1X3]
Q11  MMBT5551  G1  [SOT-23(SOT-23-3)]
Q12  AO3400A N  [SOT-23-3L]
Q13  AO3400A N  [SOT-23-3L]
R45  2KΩ ±1%  [0603_R]
R53  10KΩ ±1%  [0603_R]
R57  4.7KΩ ±1%  [0603_R]
R90  47KΩ ±1%  [0603_R]
R91  4.7KΩ ±1%  [0603_R]
R92  4.7KΩ ±1%  [0603_R]
R93  10KΩ ±1%  [0603_R]
R94  4.7KΩ ±1%  [0603_R]
U21  EL357N(B)(TA)-G  [SOP-4_P2.54]

### Ports
HALT_SW (out), ISO_3.3V (in), SIG1 (in), SIG2 (in)

### Nets
+12V: J13.A1 R45.2 R57.2 R91.2
GND: J13.A3
ISO_3.3V: R53.2 R93.2 U21.4(C) ; port ISO_3.3V  [project net +3.3V]
MCU_GND: C10.1 Q12.2(S) Q13.2(S) R94.1
HALT_out: D32.2(A) D33.2(K) R91.1 ; port SIG2
HALT_SW: C10.2 P12.2 ; port HALT_SW  [project net HALT_n]
SIG1: D32.1(A) D33.1(K) J13.A2 R57.1 ; port SIG1
NetD32_3: D32.3(K) R90.1
NetD33_3: D33.3(A) Q11.2(E)
NetP12_1: P12.1 Q13.3(D) R92.1 R93.1
NetP12_3: P12.3 Q12.3(D) R53.1
NetQ11_1: Q11.1(B) R90.2
NetQ11_3: Q11.3(C) U21.2(K)
NetQ12_1: Q12.1(G) R92.2
NetQ13_1: Q13.1(G) R94.2 U21.3(E)
NetR45_1: R45.1 U21.1(A)

### Notes on the sheet
- Signal pulled up here.
- SHEET
- Expatria Technologies
- 1136 Glade Court
- Port Coquitlam, BC V3B 1R5
- PROJECT
- SIZE
- ENGR
- MODIFIED
- DOCUMENT
- REV
- Copyright Expatria Technologies 2022. This document describes Open Hardware and is licensed under the CERN-OHL-S v2. No warranty is implied or expressed.
- EMAIL: INFO@EXPATRIA.CA
- B
- /

### Library data of the parts
C10 = 0603 100nF (104) 10% 50V: as C22 on sheet STM32F446RE_board; ComponentLink1Description: Supplier link; ComponentLink1URL: http://www.szlcsc.com/product/details_15331.html; Package: 0603; Supplier: LC; SuppliersPartNumber: C14663; Capacitance: 100nF
D32 = SOT-23 BAV23C: as D20 on sheet 2xparallelswitch; ComponentLink1Description: 供应商链接; ComponentLink1URL: http://www.szlcsc.com/product/details_70091.html; Package: SOT-23; Supplier: LC; SuppliersPartNumber: C545540
D33 = SOT-23 BAV23A: as D22 on sheet 2xparallelswitch; ComponentLink1Description: 供应商链接; ComponentLink1URL: http://www.szlcsc.com/product/details_70091.html; Package: SOT-23; Supplier: LC; SuppliersPartNumber: C328584
J13 = 3.5mm Terminal Header 3p: as J1 on sheet 2xparallelswitch; PartNumber: WJ15EDGVC-3.5-3P; PackageReference: SL_3_50_180G_03; ComponentLink1URL: http://www.weidmueller.com/; ComponentLink1Description: Manufacturer URL; Packaging: Box; Revision: V1; SuppliersPartNumber: C192778
P12 = Header 3: Header, 3-Pin; Publisher: Altium Limited; SuppliersPartNumber: C49257
Q11 = SOT-23 MMBT5551  G1: 三极管; ComponentLink1Description: 供应商链接; ComponentLink1URL: http://www.szlcsc.com/product/details_2502.html; Package: SOT-23; Supplier: LC; SuppliersPartNumber: C2145
Q12 Q13 = AO3400A N道沟 X0YV1T SOT-23: MOS(场效应管); ComponentLink1Description: 供应商链接; ComponentLink1URL: http://www.szlcsc.com/product/details_21629.html; Package: SOT-23; Supplier: LC; SuppliersPartNumber: C20917
R45 = 0603 2K (2001) 1%: as R2 on sheet 2xparallelswitch; ComponentLink1Description: Supplier link; ComponentLink1URL: http://www.szlcsc.com/product/details_23702.html; Package: 0603; Supplier: LC; SuppliersPartNumber: C22975; Resistance: 2KΩ; Tolerance: 1%
R53 R93 = 0603 10K (1002) 1%: as R18 on sheet STM32F446RE_board; ComponentLink1Description: Supplier link; ComponentLink1URL: http://www.szlcsc.com/product/details_26547.html; Package: 0603; Supplier: LC; SuppliersPartNumber: C25804; Resistance: 10KΩ; Tolerance: 1%
R57 R91 R92 R94 = 0603 4.7K (4701) 1%: as R86 on sheet STM32F446RE_board; ComponentLink1Description: Supplier link; ComponentLink1URL: http://www.szlcsc.com/product/details_23889.html; Package: 0603; Supplier: LC; SuppliersPartNumber: C23162; Resistance: 4.7KΩ; Tolerance: 1%
R90 = 0603 47K (4702) 1%: as R5 on sheet 2xparallelswitch; ComponentLink1Description: Supplier link; ComponentLink1URL: http://www.szlcsc.com/product/details_26562.html; Package: 0603; Supplier: LC; SuppliersPartNumber: C25819; Resistance: 47KΩ; Tolerance: 1%
U21 = EL357N(B)(TA)-G_[C6649]: 贴片光耦; ComponentLink1Description: 供应商链接; ComponentLink1URL: http://www.szlcsc.com/product/details_7114.html; Package: SOP-4_P2.54; Supplier: LC; SuppliersPartNumber: C6649